# EAGLE schematic bms_master_V01 (EAGLE 7.2.0), part 1 of 2

## Sheet 1 of 9
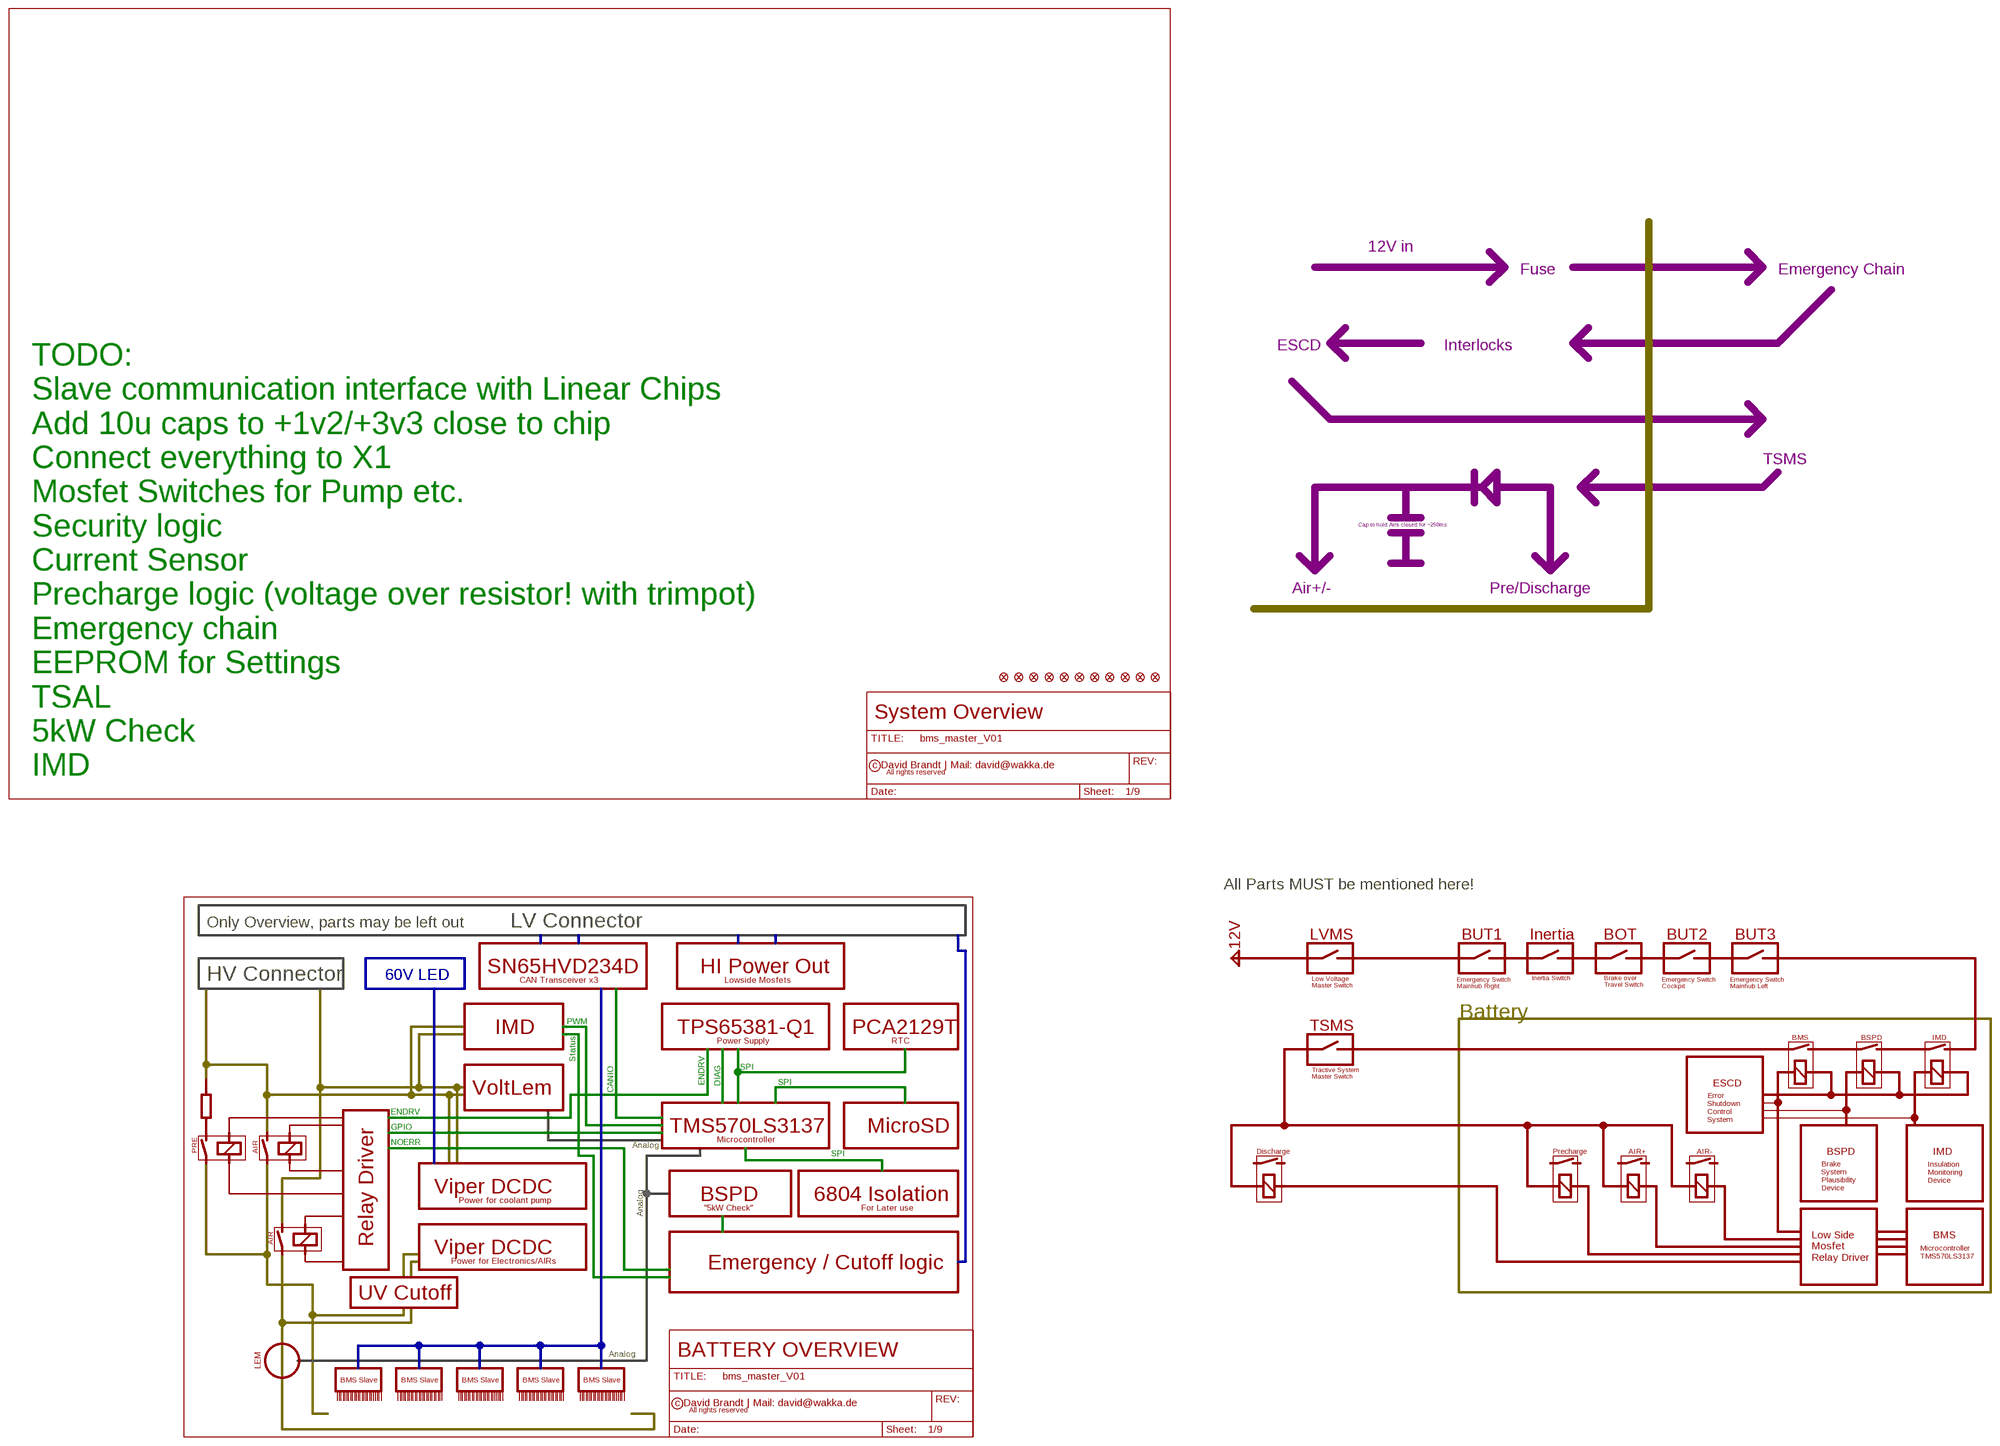
[diagram p0: schematic, sheet 1]

### Parts
FID1  FIDUCIAL""  [FIDUCIAL_1MM]
FID2  FIDUCIAL""  [FIDUCIAL_1MM]
FID3  FIDUCIAL""  [FIDUCIAL_1MM]
FID4  FIDUCIAL""  [FIDUCIAL_1MM]
FID5  FIDUCIAL""  [FIDUCIAL_1MM]
FID6  FIDUCIAL""  [FIDUCIAL_1MM]
FID7  FIDUCIAL""  [FIDUCIAL_1MM]
FID8  FIDUCIAL""  [FIDUCIAL_1MM]
FID9  FIDUCIAL""  [FIDUCIAL_1MM]
FID10  FIDUCIAL""  [FIDUCIAL_1MM]
FID11  FIDUCIAL""  [FIDUCIAL_1MM]

### Buses
B$2
B$3
B$4
B$5
B$6
B$7

### Notes on the sheet
- 12V in
- Fuse | Emergency Chain
- ESCD | Interlocks
- TSMS
- Cap to hold Airs closed for ~250ms
- Air+/- | Pre/Discharge
- TODO:
  Slave communication interface with Linear Chips
  Add 10u caps to +1v2/+3v3 close to chip
  Connect everything to X1
  Mosfet Switches for Pump etc.
  Security logic
  Current Sensor
  Precharge logic (voltage over resistor! with trimpot)
  Emergency chain
  EEPROM for Settings
  TSAL
  5kW Check
  IMD
- All Parts MUST be mentioned here!
- Only Overview, parts may be left out | LV Connector
- LVMS | BUT1 | Inertia | BOT | BUT2 | BUT3
- 12V
- SN65HVD234D | HI Power Out
- HV Connector | 60V LED | Inertia Switch
- CAN Transceiver x3 | Lowside Mosfets
- Brake over
  Travel Switch
- Low Voltage
  Master Switch
- Emergency Switch
  Mainhub Right
- Emergency Switch
  Cockpit
- Emergency Switch
  Mainhub Left
- Battery
- PWM
- IMD | TPS65381-Q1 | PCA2129T | TSMS
- BMS | BSPD | IMD
- Power Supply | RTC
- Status
- SPI
- Tractive System
  Master Switch
- ENDRV | DIAG | SPI | ESCD
- VoltLem | CANIO
- ENDRV
- Error
  Shutdown
  Control
  System
- GPIO
- TMS570LS3137 | MicroSD
- Microcontroller
- NOERR
- Analog
- PRE | AIR | Discharge | Precharge | AIR+ | AIR- | BSPD | IMD
- SPI
- Insulation
  Monitoring
  Device
- Brake
  System
  Plausibility
  Device
- Viper DCDC
- Power for coolant pump | BSPD | 6804 Isolation
- "5kW Check" | For Later use
- Analog
- BMS
- AIR
- Relay Driver
- Viper DCDC
- Microcontroller
  TMS570LS3137
- Low Side
  Mosfet
  Relay Driver
- Power for Electronics/AIRs
- Emergency / Cutoff logic
- UV Cutoff
- Analog
- LEM
- BMS Slave | BMS Slave | BMS Slave | BMS Slave | BMS Slave

## Sheet 2 of 9
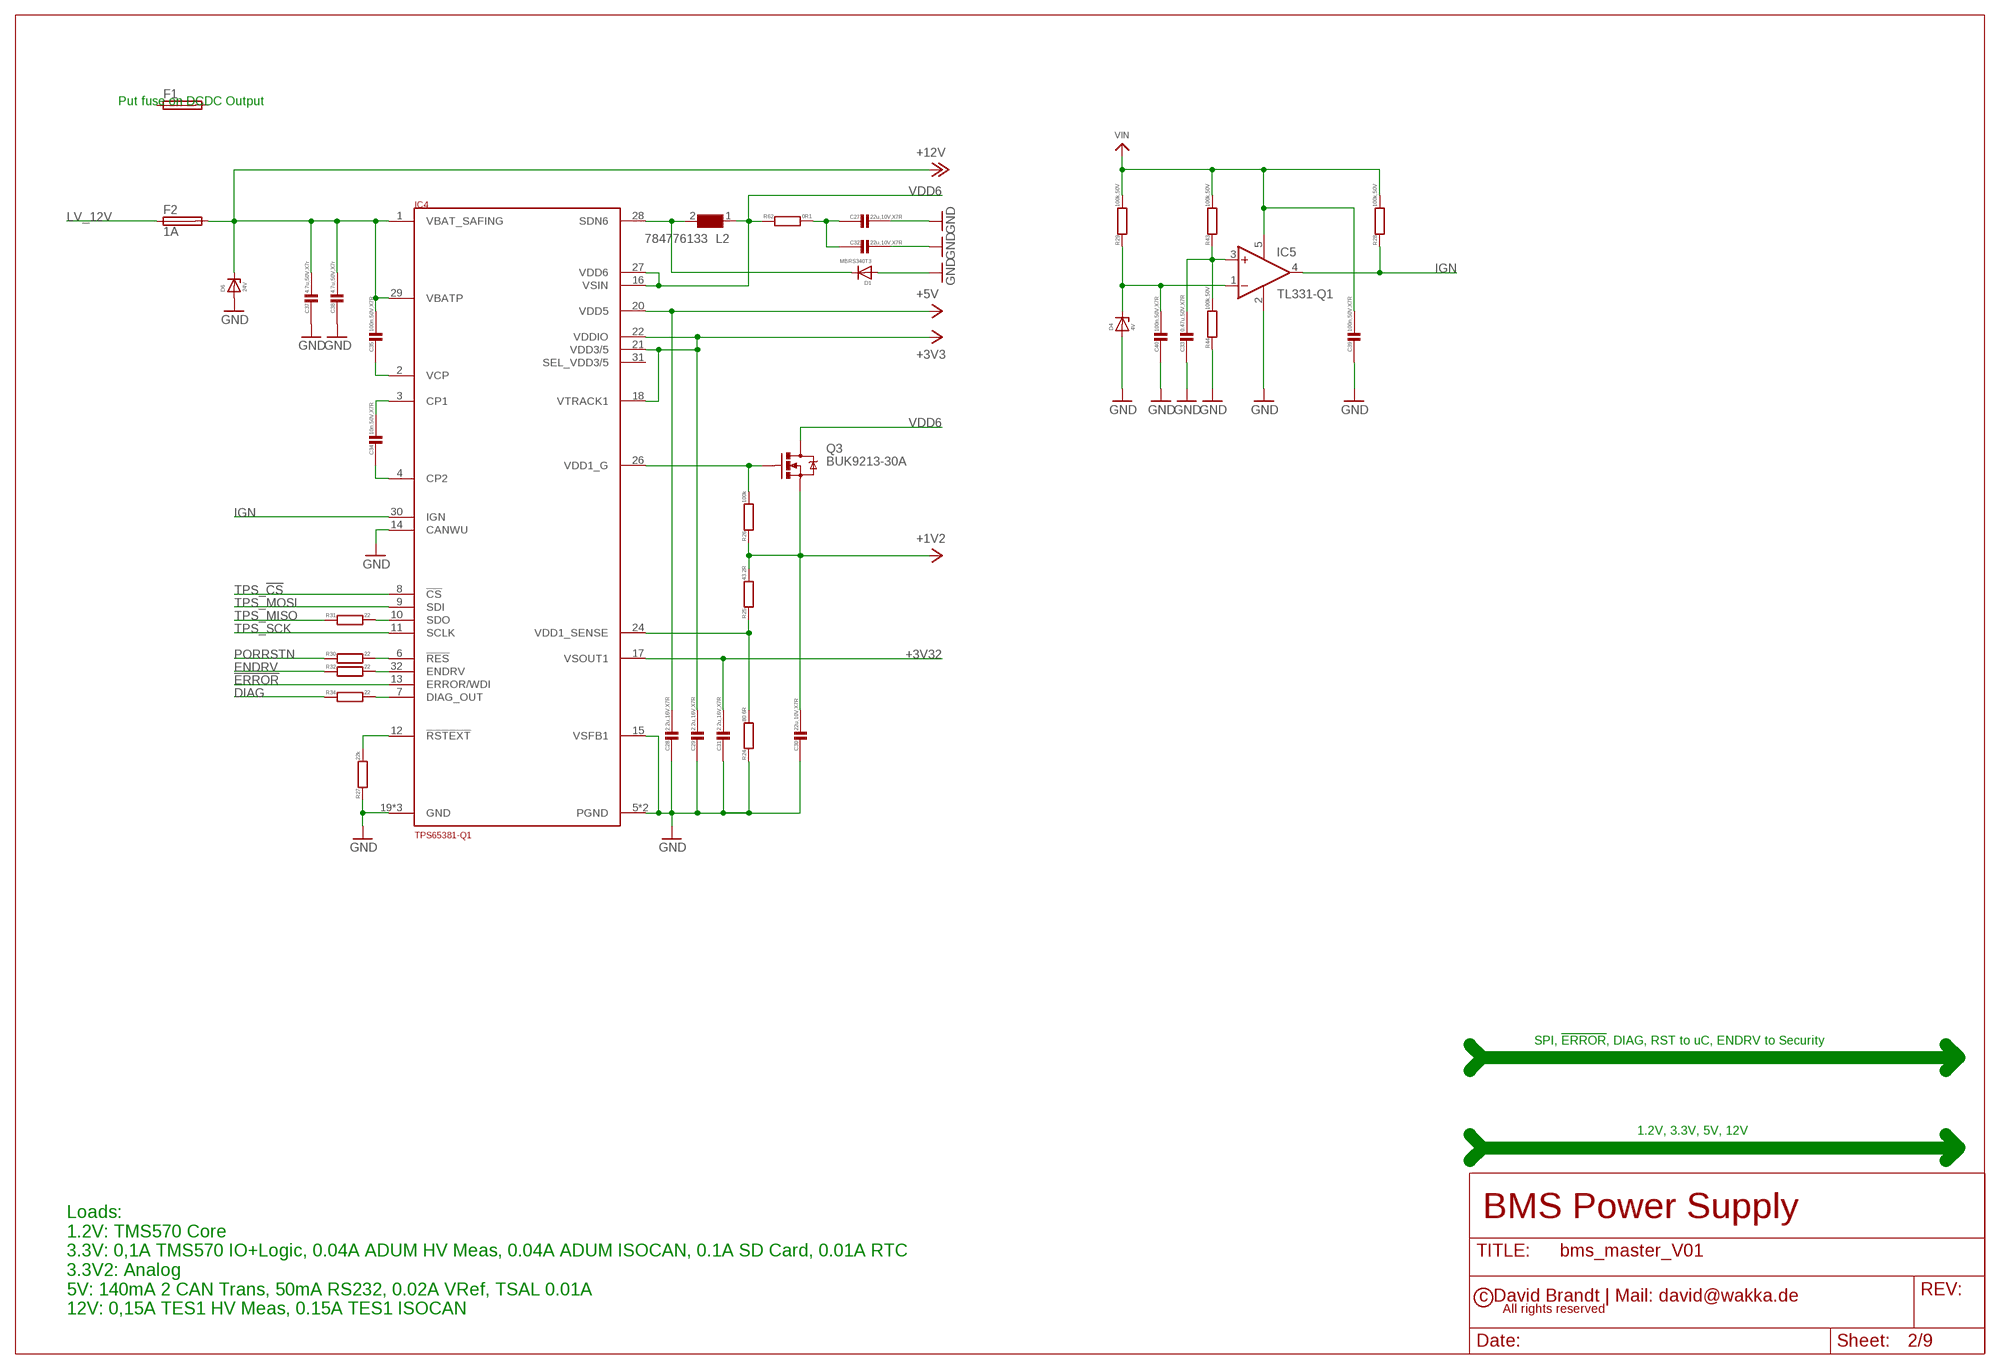
[diagram p1: schematic, sheet 2]

### Parts
C27  22u,10V,X7R  C1206  [C1206]
C28  2.2u,16V,X7R  C0603  [C0603]
C29  2.2u,16V,X7R  C0603  [C0603]
C30  22u,10V,X7R  C1206  [C1206]
C31  2.2u,16V,X7R  C0603  [C0603]
C32  22u,10V,X7R  C1206  [C1206]
C33  0.47u,50V,X7R  C0603  [C0603]
C34  10n,50V,X7R  C0603  [C0603]
C35  100n,50V,X7R  C0603  [C0603]
C37  4.7u,50V,X7r  C1210  [C1210]
C38  4.7u,50V,X7r  C1210  [C1210]
C39  100n,50V,X7R  C0603  [C0603]
C40  100n,50V,X7R  C0603  [C0603]
D1  MBRS340T3  DIODE-SMC  [SMC]
D4  4V  ZENERSOD323  [SOD323-L]
D6  24V  ZENERSMB  [SMB]
F1  FUSE-LFMINIHOLDER  [LITTLEFUSE_17867640001]
F2  1A  FUSE-LFMINIHOLDER  [LITTLEFUSE_17867640001]
IC4  TPS65381-Q1  [DAP-R-PDSO-G32]
IC5  TL331-Q1  TL331  [DBV-R-PDSO-G5]
L2  784776133  WE-PD2_1054  [WE-PD2_1054]
Q3  BUK9213-30A  MOSFET-NCHANNELFDD8780  [DPAK]
R24  80.6R  R0603  [R0603]
R25  43.2R  R0603  [R0603]
R26  100k  R0402  [R0402]
R27  22k  R0402  [R0402]
R28  100k,50V  R0603  [R0603]
R29  100k,50V  R0603  [R0603]
R30  22  R0402  [R0402]
R31  22  R0402  [R0402]
R32  22  R0402  [R0402]
R34  22  R0402  [R0402]
R43  100k,50V  R0603  [R0603]
R44  100k,50V  R0603  [R0603]
R62  0R1  R1206  [R1206]

### Nets
8VREF: C40.1 D4.C IC5.1(-IN) R29.1
!ERROR: IC4.13(ERROR/WDI) ; also sheet 6
+1V2: C30.1 Q3.3(S) R25.2 R26.1 ; also sheet 6
+3V3: C29.1 IC4.18(VTRACK1) IC4.21(VDD3/5) IC4.22(VDDIO) ; also sheet 3,4,5,6,7,8
+3V32: C31.1 IC4.17(VSOUT1) ; also sheet 6,8
+5V: C28.1 IC4.20(VDD5) ; also sheet 6,7,9
+12V: C35.1 C37.1 C38.1 D6.C F2.2 IC4.1(VBAT_SAFING) IC4.29(VBATP) ; also sheet 3,4,5,7
CP1: C34.1 IC4.3(CP1)
CP2: C34.2 IC4.4(CP2)
DIAG: R34.1 ; also sheet 8
DIAG_OUT: IC4.7(DIAG_OUT) R34.2
ENDRV: R32.1 ; also sheet 5,8
ENDRVOUT: IC4.32(ENDRV) R32.2
GND: C27.1 C28.2 C29.2 C30.2 C31.2 C32.1 C33.2 C37.2 C38.2 C39.2 C40.2 D1.A D4.A D6.A IC4.5(PGND) IC4.14(CANWU) IC4.15(VSFB1) IC4.19(GND) IC4.23(GND) IC4.25(PGND) IC4.P(GND) IC5.2(GND) R24.1 R27.1 R44.1 ; also sheet 3,4,5,6,7,8,9
IGN: IC4.30(IGN) IC5.4(OUT) R28.1
LV_12V: F2.1 ; also sheet 4
N$4: C33.1 IC5.3(+IN) R43.1 R44.2
N$6: C27.2 C32.2 R62.2
N$7: D1.C IC4.28(SDN6) L2.2
PORRSTN: R30.1 ; also sheet 6
PORRSTOUT: IC4.6(!RES) R30.2
RSTEXT: IC4.12(!RSTEXT) R27.2
SDO: IC4.10(SDO) R31.2
TPS_!CS: IC4.8(!CS) ; also sheet 8
TPS_MISO: R31.1 ; also sheet 6,8
TPS_MOSI: IC4.9(SDI) ; also sheet 6,8
TPS_SCK: IC4.11(SCLK) ; also sheet 6,8
VCP: C35.2 IC4.2(VCP)
VDD1_G: IC4.26(VDD1_G) Q3.1(G) R26.2
VDD1_SENSE: IC4.24(VDD1_SENSE) R24.2 R25.1
VDD6: IC4.16(VSIN) IC4.27(VDD6) L2.1 Q3.4(D) R62.1
VIN: C39.1 IC5.5(V+) R28.2 R29.2 R43.2 ; also sheet 9
Unconnected: F1.1 F1.2 IC4.31(SEL_VDD3/5)

### Notes on the sheet
- Put fuse on DCDC Output
- SPI, !ERROR!, DIAG, RST to uC, ENDRV to Security
- 1.2V, 3.3V, 5V, 12V
- Loads:
  1.2V: TMS570 Core
  3.3V: 0,1A TMS570 IO+Logic, 0.04A ADUM HV Meas, 0.04A ADUM ISOCAN, 0.1A SD Card, 0.01A RTC
  3.3V2: Analog
  5V: 140mA 2 CAN Trans, 50mA RS232, 0.02A VRef, TSAL 0.01A
  12V: 0,15A TES1 HV Meas, 0.15A TES1 ISOCAN

## Sheet 3 of 9
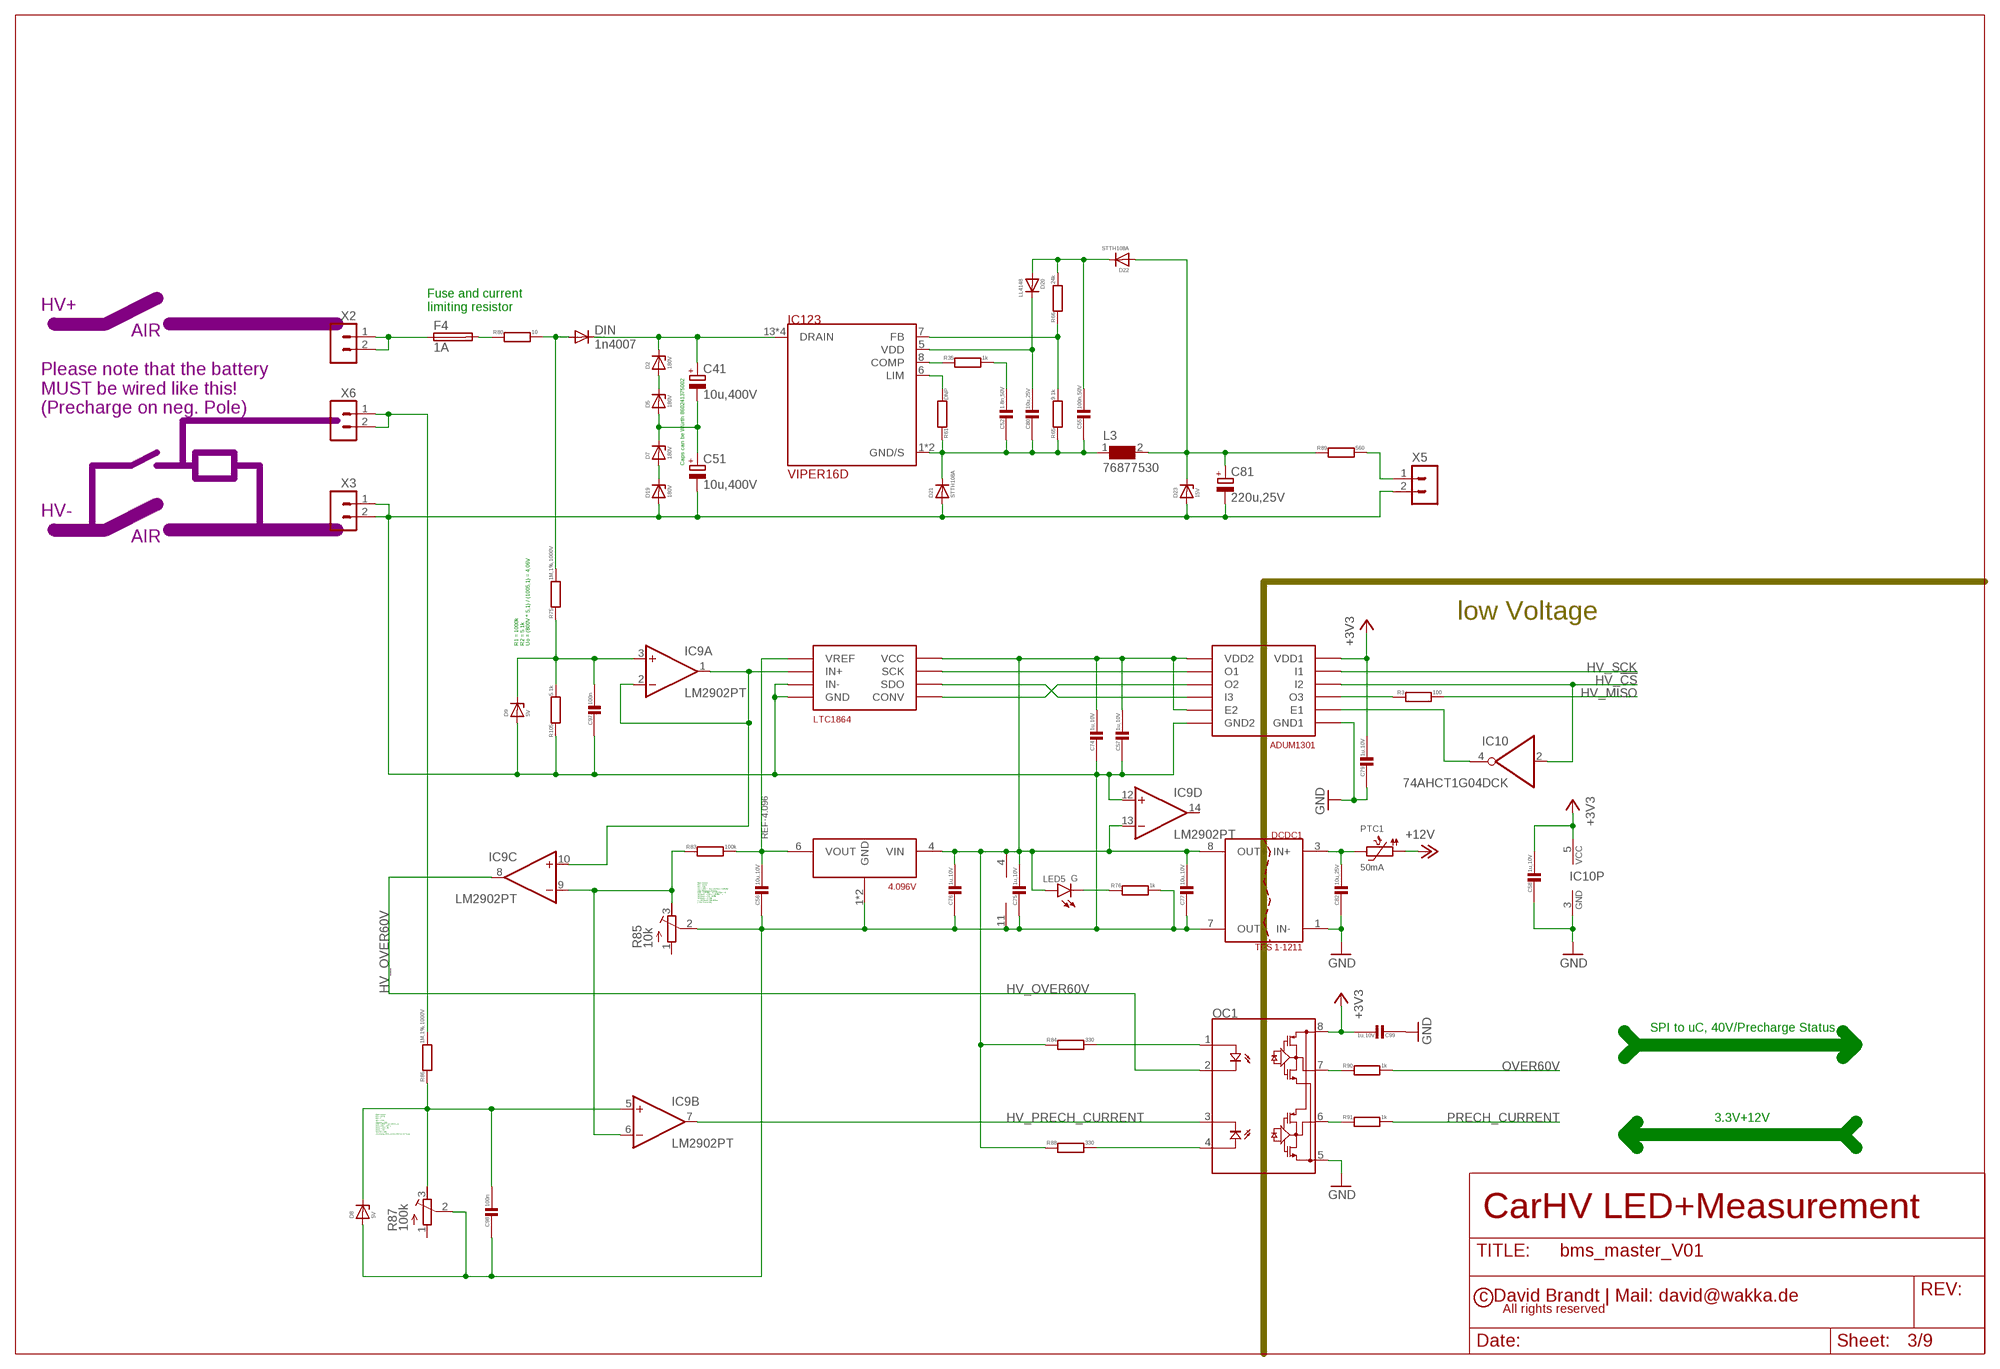
[diagram p2: schematic, sheet 3]

### Parts
C41  10u,400V  CPOL-EUE5-10.5  [E5-10,5]
C51  10u,400V  CPOL-EUE5-10.5  [E5-10,5]
C52  1.8n,50V  C0603  [C0603]
C55  100n,50V  C0603  [C0603]
C56  10u,10V  C0603  [C0603]
C57  1u,10V  C0402  [C0402]
C58  1u,10V  C0402  [C0402]
C74  1u,10V  C0402  [C0402]
C75  1u,10V  C0402  [C0402]
C76  1u,10V  C0402  [C0402]
C77  10u,10V  C0603  [C0603]
C79  1u,10V  C0402  [C0402]
C80  10u,25V  C1210  [C1210]
C81  220u,25V  CPOL-EUE3.5-8  [E3,5-8]
C82  10u,25V  C1210  [C1210]
C97  100n  C0603  [C0603]
C98  100n  C0603  [C0603]
C99  1u,10V  C0402  [C0402]
D2  180V  ZENERSMA  [DO-214AC]
D5  180V  ZENERSMA  [DO-214AC]
D7  180V  ZENERSMA  [DO-214AC]
D8  5V  ZENERSOD323  [SOD323-L]
D9  5V  ZENERSOD323  [SOD323-L]
D19  180V  ZENERSMA  [DO-214AC]
D20  LL4148  DIODE-MINIMELF  [MINIMELF]
D21  STTH108A  DIODE-SMA  [DO-214AC]
D22  STTH108A  DIODE-SMA  [DO-214AC]
D23  15V  ZENERSMA  [DO-214AC]
DCDC1  TES 1-1211  DCDC_ISOSMD_TES1  [DCDC_SMD_TES1]
DIN  1n4007  DIODE-DO-214AC  [DO-214AC]
F4  1A  FUSE-LF485  [LF485]
IC9  LM2902PT  [SSOP14]
IC10  74AHCT1G04DCK  [SC70-5]
IC123  VIPER16D  [SO16]
L3  76877530  WE-PD2_HV_7850  [WE-PD2_7850]
LED5  G  LED0603  [CHIPLED_0603]
OC1  ACPL-K7X  [SO-8-STRETCHED]
PTC1  50mA  PTC1210  [PTC1210]
R3  100  R0402  [R0402]
R35  1k  R0603  [R0603]
R61  DNP  R0603  [R0603]
R65  9.1k  R0603  [R0603]
R66  24k  R0603  [R0603]
R75  1M,1%,1000V  R2512  [R2512]
R76  1k  R0402  [R0402]
R80  10  R1206  [R1206]
R83  100k  R0402  [R0402]
R84  330  R0402  [R0402]
R85  10k  R-TRIMM3224W  [RTRIM3224W]
R86  1M,1%,1000V  R2512  [R2512]
R87  100k  R-TRIMM3224W  [RTRIM3224W]
R88  330  R0402  [R0402]
R89  560  R1206  [R1206]
R90  1k  R0402  [R0402]
R91  1k  R0402  [R0402]
R105  5.1k  R1206  [R1206]
U$3  4.096V  LT6656  [SOT23-6]
U$20  LTC1864  [MS8]
U$22  ADUM1301  [SO16WB]
X2  HEADER_POS2_43650-0212  [43650-0212]
X3  HEADER_POS2_43650-0212  [43650-0212]
X5  HEADER_POS2_43650-0212  [43650-0212]
X6  HEADER_POS2_43650-0212  [43650-0212]

### Nets
+3V3: C58.1 C79.1 C99.1 IC10.5(VCC) OC1.8 U$22.P$1(VDD1) ; also sheet 2,4,5,6,7,8
+12V: PTC1.P$1 ; also sheet 2,4,5,7
CHV_5V: C57.1 C74.1 C75.1 C76.1 C77.1 DCDC1.8(OUT+) IC9.4(P:V+) IC9.13(D:-IN) LED5.A R84.1 R88.1 U$3.4(VIN) U$20.P$8(VCC) U$22.P$10(E2) U$22.P$16(VDD2)
CHV_+: F4.1 X2.1 X2.2
CHV_+_FUSED: F4.2 R80.1
CHV_+_FUSEDR: DIN.A R75.2 R80.2
CHV_CONV: U$20.P$5(CONV) U$22.P$13(O2)
CHV_GND: C51.- C56.2 C57.2 C74.2 C75.2 C76.2 C77.2 C81.- C97.2 C98.2 D8.A D9.A D19.A D21.A D23.A DCDC1.7(OUT-) IC9.11(P:V-) IC9.12(D:+IN) R76.2 R85.2(S) R87.2(S) R105.1 U$3.1(GND) U$3.2(GND) U$20.P$3(IN-) U$20.P$4(GND) U$22.P$9(GND2) U$22.P$15(GND2) X3.1 X3.2 X5.2
CHV_LEDC: LED5.C R76.1
CHV_M: C97.1 D9.C IC9.3(A:+IN) R75.1 R105.2
CHV_M1: C98.1 D8.C IC9.5(B:+IN) R86.1 R87.3(E)
CHV_MOP: IC9.1(A:OUT) IC9.2(A:-IN) IC9.10(C:+IN) U$20.P$2(IN+)
CHV_SCK: U$20.P$7(SCK) U$22.P$14(O1)
CHV_SDO: U$20.P$6(SDO) U$22.P$12(I3)
CLV_12V_TES1_FUSED: C82.1 DCDC1.3(IN+) PTC1.P$2
GND: C58.2 C79.2 C82.2 C99.2 DCDC1.1(IN-) IC10.3(GND) OC1.5 U$22.P$2(GND1) U$22.P$8(GND1) ; also sheet 2,4,5,6,7,8,9
HV_!CS: IC10.2(I) U$22.P$4(I2) ; also sheet 8
HV_MISO: R3.2 ; also sheet 8
HV_OVER60V: IC9.8(C:OUT) OC1.2
HV_PRECH_CURRENT: IC9.7(B:OUT) OC1.3
HV_SCK: U$22.P$3(I1) ; also sheet 8
N$1: IC10.4(O) U$22.P$7(E1)
N$3: R3.1 U$22.P$5(O3)
N$72: R86.2 X6.1 X6.2
N$73: OC1.1 R84.2
N$74: OC1.4 R88.2
OVER60V: R90.2 ; also sheet 4,8
PRECH_CURRENT: R91.2 ; also sheet 5,8
R!OVER40V: OC1.7 R90.1
R!PRECH_CURRENT: OC1.6 R91.1
REF0.3W: IC9.6(B:-IN) IC9.9(C:-IN) R83.1 R85.3(E)
REF-4.096: C56.1 R83.2 U$3.6(VOUT) U$20.P$1(VREF)
VP+3/4: D7.A D19.C
VP_12V: C81.+ D22.A D23.C L3.2 R89.1
VP_12VINT: C55.1 D20.A D22.C R66.2
VP_+: C41.+ D2.C DIN.C IC123.13(DRAIN) IC123.14(DRAIN) IC123.15(DRAIN) IC123.16(DRAIN)
VP_+1/3: D2.A D5.C
VP_+/2: C41.- C51.+ D5.A D7.C
VP_COMP: IC123.8(COMP) R35.1
VP_COMPM: C52.1 R35.2
VP_FB: IC123.7(FB) R65.2 R66.1
VP_LED: R89.2 X5.1
VP_LIM: IC123.6(LIM) R61.2
VP_S: C52.2 C55.2 C80.2 D21.C IC123.1(GND/S) IC123.2(GND/S) L3.1 R61.1 R65.1
VP_VDD: C80.1 D20.C IC123.5(VDD)
Unconnected: IC9.14(D:OUT) R85.1(A) R87.1(A)

### Notes on the sheet
- HV+
- Fuse and current
  limiting resistor
- AIR
- Please note that the battery
  MUST be wired like this!
  (Precharge on neg. Pole)
- Caps can be Würth 860241375002
- HV-
- AIR
- low Voltage
- R1 = 1000k
  R2 = 5.1k
  Uo = (800V * 5,1) / (1005,1) = 4,06V
- Main divider:
  R1 = 1000k
  R2 = 5.1k
  Uo = (60V * 5,1) / (1005,1) = 0.3045V
  0.3V Reference Divider:
  0.3V = (4.096V * x) / (100Ohm + x)
  30OhmV + 0.3Vx = 4.096V * x
  30Ohm/x + 0.3= 4.096
  30Ohm/x = 3.796
  x = 30Ohm/3.796 =8Ohm
  (~10k Pot is OK)
- SPI to uC, 40V/Precharge Status
- 3.3V+12V
- Main divider:
  R1 = 1000k
  R2 = ?
  Uo = 0.3V
  Uimean = 10V
  0.3V = (10V * x) / (1000 + x)
  300 + 0.3x = 10 * x
  300/x + 0.3 = 10
  300/x = 9.7
  300/9.7 = 30k
  choosing 100k pot for 30V to 0V Span

## Sheet 4 of 9
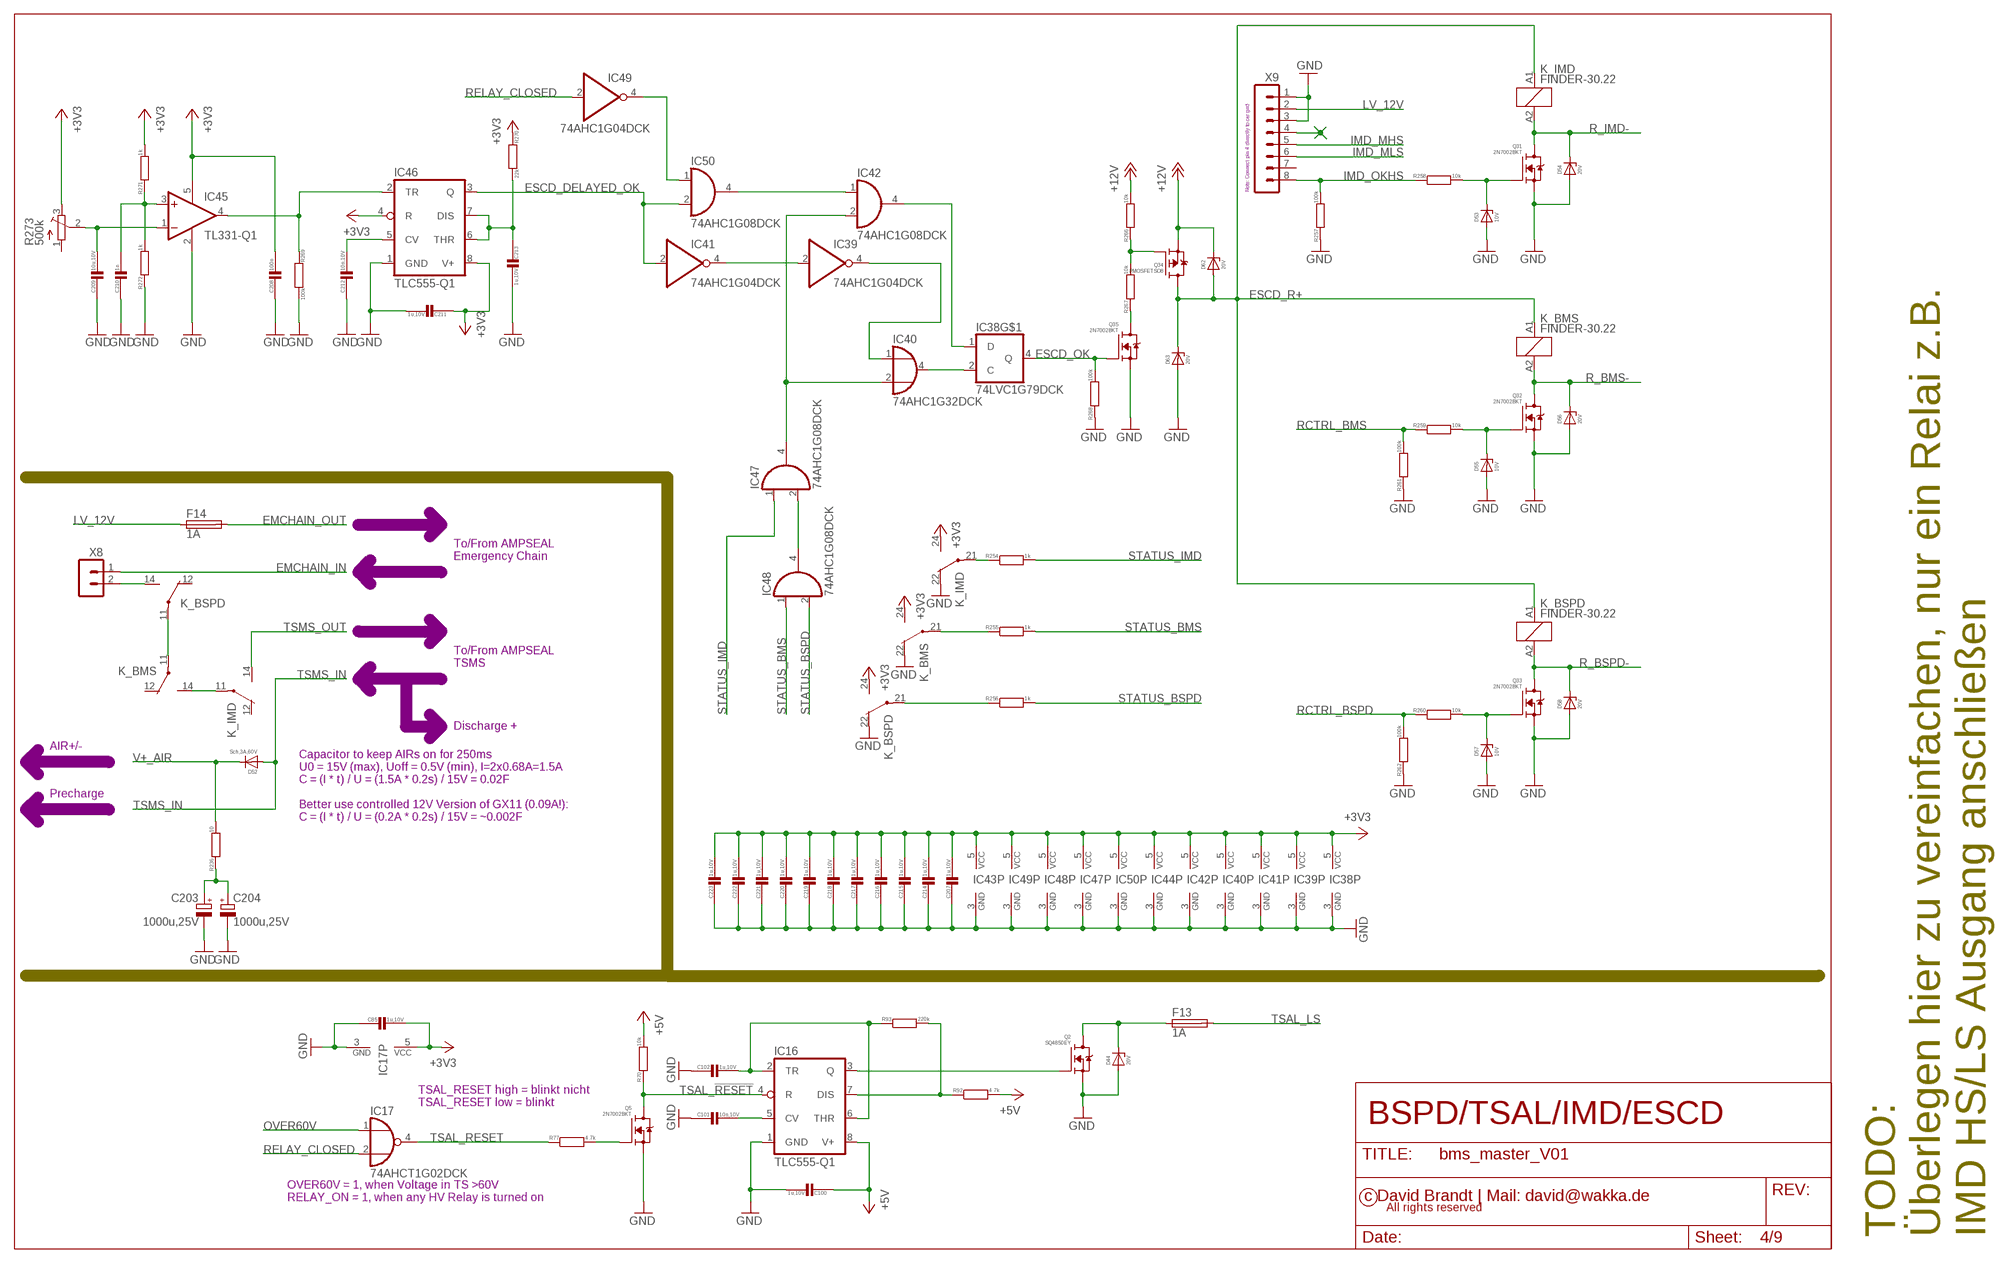
[diagram p3: schematic, sheet 4]

### Parts
C85  1u,10V  C0402  [C0402]
C100  1u,10V  C0402  [C0402]
C101  10n,10V  C0402  [C0402]
C102  1u,10V  C0402  [C0402]
C203  1000u,25V  CPOL-EUE5-13  [E5-13]
C204  1000u,25V  CPOL-EUE5-13  [E5-13]
C207  1u,10V  C0402  [C0402]
C208  100n  C0402  [C0402]
C209  10u,10V  C0603  [C0603]
C210  1n  C0402  [C0402]
C211  1u,10V  C0402  [C0402]
C212  10n,10V  C0402  [C0402]
C213  1u,10V  C0402  [C0402]
C214  1u,10V  C0402  [C0402]
C215  1u,10V  C0402  [C0402]
C216  1u,10V  C0402  [C0402]
C217  1u,10V  C0402  [C0402]
C218  1u,10V  C0402  [C0402]
C219  1u,10V  C0402  [C0402]
C220  1u,10V  C0402  [C0402]
C221  1u,10V  C0402  [C0402]
C222  1u,10V  C0402  [C0402]
C223  1u,10V  C0402  [C0402]
D44  20V  ZENERSMA  [DO-214AC]
D52  Sch,3A,60V  DIODE-SMA  [DO-214AC]
D53  10V  ZENERSOD323  [SOD323-L]
D54  20V  ZENERSMA  [DO-214AC]
D55  10V  ZENERSOD323  [SOD323-L]
D56  20V  ZENERSMA  [DO-214AC]
D57  10V  ZENERSOD323  [SOD323-L]
D58  20V  ZENERSMA  [DO-214AC]
D62  20V  ZENERSMA  [DO-214AC]
D63  20V  ZENERSMA  [DO-214AC]
F13  1A  FUSE-LFMINIHOLDER  [LITTLEFUSE_17867640001]
F14  1A  FUSE-LFMINIHOLDER  [LITTLEFUSE_17867640001]
IC16  TLC555-Q1  NE555D  [SO08]
IC17  74AHCT1G02DCK  [SC70-5]
IC38  74LVC1G79DCK  [SC70-5]
IC39  74AHC1G04DCK  [SC70-5]
IC40  74AHC1G32DCK  [SC70-5]
IC41  74AHC1G04DCK  [SC70-5]
IC42  74AHC1G08DCK  [SC70-5]
IC43  74AHC1G32DCK  [SC70-5]
IC44  74AHC1G02DCK  [SC70-5]
IC45  TL331-Q1  TL331  [DBV-R-PDSO-G5]
IC46  TLC555-Q1  NE555D  [SO08]
IC47  74AHC1G08DCK  [SC70-5]
IC48  74AHC1G08DCK  [SC70-5]
IC49  74AHC1G04DCK  [SC70-5]
IC50  74AHC1G08DCK  [SC70-5]
K_BMS  FINDER-30.22  [FINDER-30.22]
K_BSPD  FINDER-30.22  [FINDER-30.22]
K_IMD  FINDER-30.22  [FINDER-30.22]
Q2  SQ4850EY  NMOSFETSO8  [SO-8]
Q5  2N7002BKT  [SOT416]
Q31  2N7002BKT  [SOT416]
Q32  2N7002BKT  [SOT416]
Q33  2N7002BKT  [SOT416]
Q34  PMOSFETSO8  [SO-8]
Q35  2N7002BKT  [SOT416]
R70  10k  R0402  [R0402]
R77  4.7k  R0402  [R0402]
R92  4.7k  R0402  [R0402]
R93  220k  R0402  [R0402]
R236  10  R1206  [R1206]
R254  1k  R0402  [R0402]
R255  1k  R0402  [R0402]
R256  1k  R0402  [R0402]
R257  100k  R0402  [R0402]
R258  10k  R0402  [R0402]
R259  10k  R0402  [R0402]
R260  10k  R0402  [R0402]
R261  100k  R0402  [R0402]
R262  100k  R0402  [R0402]
R266  10k  R0402  [R0402]
R267  10k  R0402  [R0402]
R268  100k  R0402  [R0402]
R269  100k  R0402  [R0402]
R270  22k  R0402  [R0402]
R271  1k  R0402  [R0402]
R272  1k  R0402  [R0402]
R273  500k  TRIM_EU-3223W  [3223W]
X8  HEADER_POS2_43650-0212  [43650-0212]
X9  HEADER_POS8_43650-0812  [43650-0812]

### Nets
8VREF1: C209.1 IC45.1(-IN) R273.2(S)
+3V3: C85.1 C207.1 C208.1 C211.2 C214.1 C215.1 C216.1 C217.1 C218.1 C219.1 C220.1 C221.1 C222.1 C223.1 IC17.5(VCC) IC38.5(VCC) IC39.5(VCC) IC40.5(VCC) IC41.5(VCC) IC42.5(VCC) IC43.5(VCC) IC44.5(VCC) IC45.5(V+) IC46.4(R) IC46.8(V+) IC47.5(VCC) IC48.5(VCC) IC49.5(VCC) IC50.5(VCC) K_BMS.24(-2:S) K_BSPD.24(-2:S) K_IMD.24(-2:S) R270.1 R271.2 R273.3(E) ; also sheet 2,3,5,6,7,8
+12V: D62.C Q34.1(S) Q34.2(S) Q34.3(S) R266.2 ; also sheet 2,3,5,7
CAR+5V: C100.2 IC16.8(V+) R70.2 R92.2 ; supply symbol labelled +5V
EMCHAIN_IN: X8.1
EMCHAIN_OUT: F14.2
ESCD_DELAYED_OK: IC41.2(I) IC46.3(Q) IC50.2(I1)
ESCD_OK: IC38.4(Q) Q35.1(G) R268.2
ESCD_R+: D62.A D63.C K_BMS.A1 K_BSPD.A1 K_IMD.A1 Q34.5(D) Q34.6(D) Q34.7(D) Q34.8(D)
GND: C85.2 C100.1 C101.2 C102.2 C203.- C204.- C207.2 C208.2 C209.2 C210.2 C211.1 C212.2 C213.1 C214.2 C215.2 C216.2 C217.2 C218.2 C219.2 C220.2 C221.2 C222.2 C223.2 D44.A D53.A D54.A D55.A D56.A D57.A D58.A D63.A IC16.1(GND) IC17.3(GND) IC38.3(GND) IC39.3(GND) IC40.3(GND) IC41.3(GND) IC42.3(GND) IC43.3(GND) IC44.3(GND) IC45.2(GND) IC46.1(GND) IC47.3(GND) IC48.3(GND) IC49.3(GND) IC50.3(GND) K_BMS.22(-2:O) K_BSPD.22(-2:O) K_IMD.22(-2:O) Q2.1(S) Q2.2(S) Q2.3(S) Q5.2(S) Q31.2(S) Q32.2(S) Q33.2(S) Q35.2(S) R257.1 R261.1 R262.1 R268.1 R269.2 R272.1 X9.1 X9.3 ; also sheet 2,3,5,6,7,8,9
IMD_MHS: X9.5
IMD_MLS: X9.6
IMD_OKHS: R257.2 R258.1 X9.8
LV_12V: F14.1 X9.2 ; also sheet 2
N$83: IC16.3(Q) Q2.4(G)
N$168: K_BSPD.14(-1:S) X8.2
N$169: K_BMS.11(-1:P) K_BSPD.11(-1:P)
N$170: K_BMS.14(-1:S) K_IMD.11(-1:P)
N$171: C203.+ C204.+ R236.1
N$172: K_BSPD.21(-2:P) R256.1
N$173: K_BMS.21(-2:P) R255.1
N$174: K_IMD.21(-2:P) R254.1
N$176: X9.4
N$177: D53.C Q31.1(G) R258.2
N$178: D55.C Q32.1(G) R259.2
N$179: D57.C Q33.1(G) R260.2
N$181: Q34.4(G) R266.1 R267.2
N$182: Q35.3(D) R267.1
N$183: IC38.2(C) IC40.4(O)
N$184: IC39.4(O) IC40.1(I0)
N$185: IC39.2(I) IC41.4(O)
N$186: IC38.1(D) IC42.4(O)
N$187: IC40.2(I1) IC42.2(I1) IC47.4(O)
N$188: IC47.2(I1) IC48.4(O)
N$189: C210.1 IC45.3(+IN) R271.1 R272.2
N$190: IC45.4(OUT) IC46.2(TR) R269.1
N$191: C213.2 IC46.6(THR) IC46.7(DIS) R270.2
N$193: IC42.1(I0) IC50.4(O)
N$194: IC49.4(O) IC50.1(I0)
OVER60V: IC17.1(I0) ; also sheet 3,8
R_BMS-: D56.C K_BMS.A2 Q32.3(D)
R_BSPD-: D58.C K_BSPD.A2 Q33.3(D)
R_IMD-: D54.C K_IMD.A2 Q31.3(D)
RCTRL_BMS: R259.1 R261.2
RCTRL_BSPD: R260.1 R262.2
RELAY_CLOSED: IC17.2(I1) IC49.2(I) ; also sheet 5,8
STATUS_BMS: IC48.1(I0) R255.2 ; also sheet 8
STATUS_BSPD: IC48.2(I1) R256.2 ; also sheet 8
STATUS_IMD: IC47.1(I0) R254.2 ; also sheet 8
TSAL_!RESET: IC16.4(R) Q5.3(D) R70.1
TSAL_CV: C101.1 IC16.5(CV)
TSAL_CV1: C212.1 IC46.5(CV)
TSAL_DIS: IC16.7(DIS) R92.1 R93.2
TSAL_DRAIN: D44.C F13.1 Q2.5(D) Q2.6(D) Q2.7(D) Q2.8(D)
TSAL_ENG: Q5.1(G) R77.2
TSAL_LS: F13.2
TSAL_RESET: IC17.4(O) R77.1
TSAL_TR: C102.1 IC16.2(TR) IC16.6(THR) R93.1
TSMS_IN: D52.A
TSMS_OUT: K_IMD.14(-1:S)
V+_AIR: D52.C R236.2
Unconnected: IC43.1(I0) IC43.2(I1) IC43.4(O) IC44.1(I0) IC44.2(I1) IC44.4(O) K_BMS.12(-1:O) K_BSPD.12(-1:O) K_IMD.12(-1:O) R273.1(A) X9.7

### Notes on the sheet
- Note: Connect pin 4 directly to car gnd
- To/From AMPSEAL
  Emergency Chain
- To/From AMPSEAL
  TSMS
- Discharge +
- AIR+/-
- Capacitor to keep AIRs on for 250ms
  U0 = 15V (max), Uoff = 0.5V (min), I=2x0.68A=1.5A
  C = (I * t) / U = (1.5A * 0.2s) / 15V = 0.02F
  
  Better use controlled 12V Version of GX11 (0.09A!):
  C = (I * t) / U = (0.2A * 0.2s) / 15V = ~0.002F
- Precharge
- TSAL_RESET high = blinkt nicht
  TSAL_RESET low = blinkt
- OVER60V = 1, when Voltage in TS >60V
  RELAY_ON = 1, when any HV Relay is turned on
- TODO:
  Überlegen hier zu vereinfachen, nur ein Relai z.B.
  IMD HS/LS Ausgang anschließen

## Sheet 5 of 9
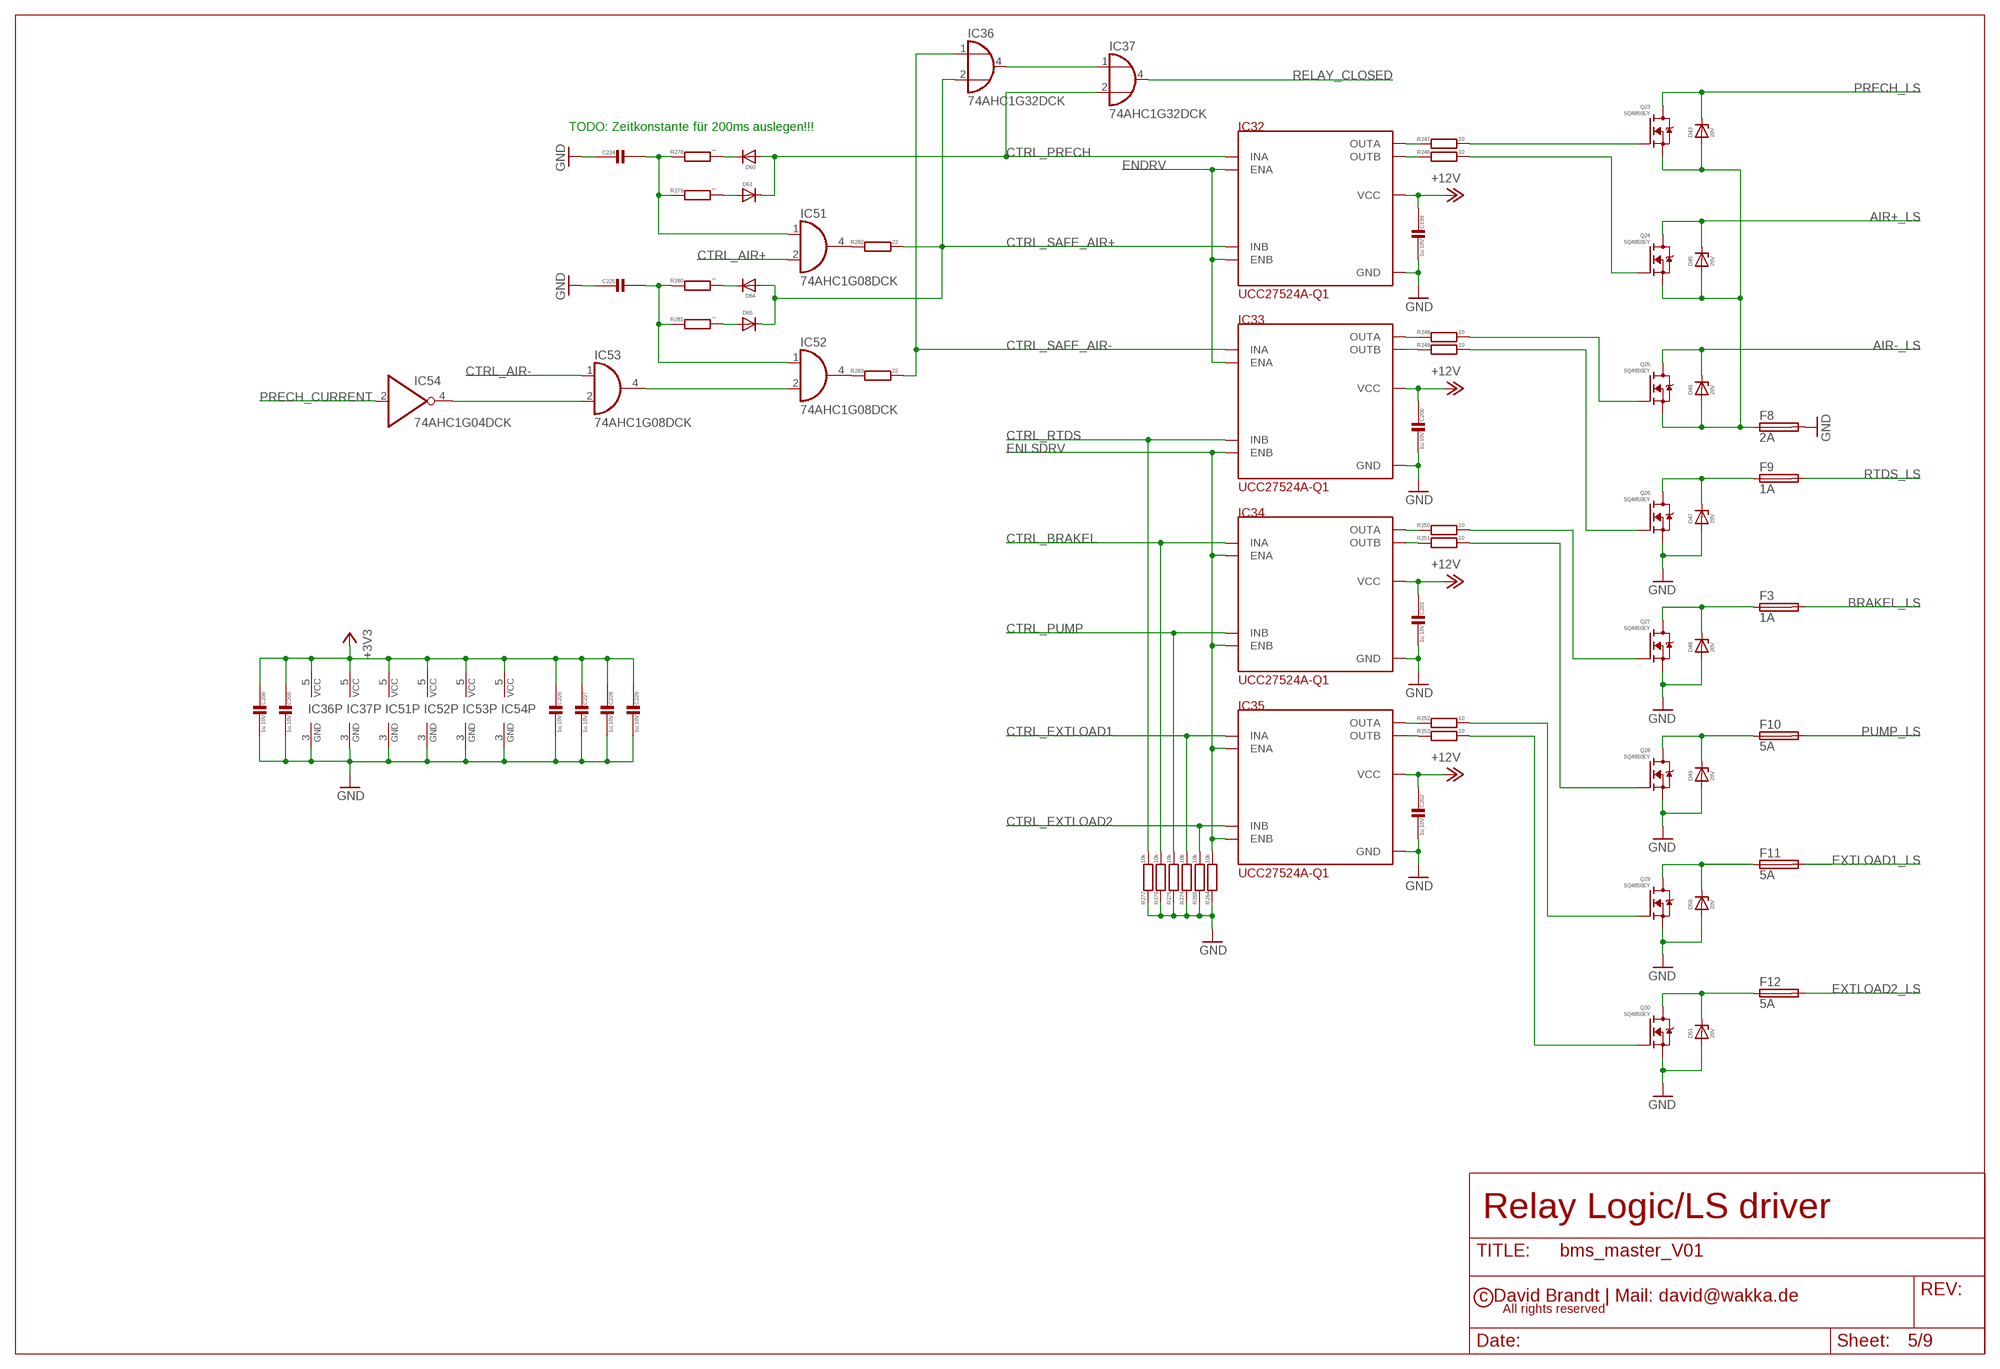
[diagram p4: schematic, sheet 5]

### Parts
C199  1u,10V  C0402  [C0402]
C200  1u,10V  C0402  [C0402]
C201  1u,10V  C0402  [C0402]
C202  1u,10V  C0402  [C0402]
C205  1u,10V  C0402  [C0402]
C206  1u,10V  C0402  [C0402]
C224  C0402  [C0402]
C225  C0402  [C0402]
C226  1u,10V  C0402  [C0402]
C227  1u,10V  C0402  [C0402]
C228  1u,10V  C0402  [C0402]
C229  1u,10V  C0402  [C0402]
D43  20V  ZENERSMA  [DO-214AC]
D45  20V  ZENERSMA  [DO-214AC]
D46  20V  ZENERSMA  [DO-214AC]
D47  20V  ZENERSMA  [DO-214AC]
D48  20V  ZENERSMA  [DO-214AC]
D49  20V  ZENERSMA  [DO-214AC]
D50  20V  ZENERSMA  [DO-214AC]
D51  20V  ZENERSMA  [DO-214AC]
D60  DIODE-SOD523  [SOD523]
D61  DIODE-SOD523  [SOD523]
D64  DIODE-SOD523  [SOD523]
D65  DIODE-SOD523  [SOD523]
F3  1A  FUSE-LFMINIHOLDER  [LITTLEFUSE_17867640001]
F8  2A  FUSE-LFMINIHOLDER  [LITTLEFUSE_17867640001]
F9  1A  FUSE-LFMINIHOLDER  [LITTLEFUSE_17867640001]
F10  5A  FUSE-LFMINIHOLDER  [LITTLEFUSE_17867640001]
F11  5A  FUSE-LFMINIHOLDER  [LITTLEFUSE_17867640001]
F12  5A  FUSE-LFMINIHOLDER  [LITTLEFUSE_17867640001]
IC32  UCC27524A-Q1  UCC27XXX-Q1  [SO08]
IC33  UCC27524A-Q1  UCC27XXX-Q1  [SO08]
IC34  UCC27524A-Q1  UCC27XXX-Q1  [SO08]
IC35  UCC27524A-Q1  UCC27XXX-Q1  [SO08]
IC36  74AHC1G32DCK  [SC70-5]
IC37  74AHC1G32DCK  [SC70-5]
IC51  74AHC1G08DCK  [SC70-5]
IC52  74AHC1G08DCK  [SC70-5]
IC53  74AHC1G08DCK  [SC70-5]
IC54  74AHC1G04DCK  [SC70-5]
Q23  SQ4850EY  NMOSFETSO8  [SO-8]
Q24  SQ4850EY  NMOSFETSO8  [SO-8]
Q25  SQ4850EY  NMOSFETSO8  [SO-8]
Q26  SQ4850EY  NMOSFETSO8  [SO-8]
Q27  SQ4850EY  NMOSFETSO8  [SO-8]
Q28  SQ4850EY  NMOSFETSO8  [SO-8]
Q29  SQ4850EY  NMOSFETSO8  [SO-8]
Q30  SQ4850EY  NMOSFETSO8  [SO-8]
R246  10  R1206  [R1206]
R247  10  R1206  [R1206]
R248  10  R1206  [R1206]
R249  10  R1206  [R1206]
R250  10  R1206  [R1206]
R251  10  R1206  [R1206]
R252  10  R1206  [R1206]
R253  10  R1206  [R1206]
R264  10k  R1206  [R1206]
R265  10k  R1206  [R1206]
R274  10k  R1206  [R1206]
R275  10k  R1206  [R1206]
R276  10k  R1206  [R1206]
R277  10k  R1206  [R1206]
R278  ""  R0402  [R0402]
R279  ""  R0402  [R0402]
R280  ""  R0402  [R0402]
R281  ""  R0402  [R0402]
R282  22  R0402  [R0402]
R283  22  R0402  [R0402]

### Nets
+3V3: C205.2 C206.2 C226.2 C227.2 C228.2 C229.2 IC36.5(VCC) IC37.5(VCC) IC51.5(VCC) IC52.5(VCC) IC53.5(VCC) IC54.5(VCC) ; also sheet 2,3,4,6,7,8
+12V: C199.2 C200.2 C201.2 C202.2 IC32.6(VCC) IC33.6(VCC) IC34.6(VCC) IC35.6(VCC) ; also sheet 2,3,4,7
AIR+_LS: D45.C Q24.5(D) Q24.6(D) Q24.7(D) Q24.8(D)
AIR-_LS: D46.C Q25.5(D) Q25.6(D) Q25.7(D) Q25.8(D)
BRAKEL_LS: F3.2
CTRL_AIR+: IC51.2(I1) ; also sheet 8
CTRL_AIR-: IC53.1(I0) ; also sheet 8
CTRL_BRAKEL: IC34.2(INA) R276.2 ; also sheet 8,9
CTRL_EXTLOAD1: IC35.2(INA) R274.2 ; also sheet 8
CTRL_EXTLOAD2: IC35.4(INB) R265.2 ; also sheet 8
CTRL_PRECH: D60.A D61.C IC32.2(INA) IC37.2(I1) ; also sheet 8
CTRL_PUMP: IC34.4(INB) R275.2 ; also sheet 8,9
CTRL_RTDS: IC33.4(INB) R277.2 ; also sheet 8,9
CTRL_SAFE_AIR+: D64.A D65.C IC32.4(INB) IC36.2(I1) R282.2 ; also sheet 8
CTRL_SAFE_AIR-: IC33.2(INA) IC36.1(I0) R283.2 ; also sheet 8
ENDRV: IC32.1(ENA) IC32.8(ENB) IC33.1(ENA) ; also sheet 2,8
ENLSDRV: IC33.8(ENB) IC34.1(ENA) IC34.8(ENB) IC35.1(ENA) IC35.8(ENB) R264.2 ; also sheet 8
EXTLOAD1_LS: F11.2
EXTLOAD2_LS: F12.2
GND: C199.1 C200.1 C201.1 C202.1 C205.1 C206.1 C224.2 C225.2 C226.1 C227.1 C228.1 C229.1 D47.A D48.A D49.A D50.A D51.A F8.2 IC32.3(GND) IC33.3(GND) IC34.3(GND) IC35.3(GND) IC36.3(GND) IC37.3(GND) IC51.3(GND) IC52.3(GND) IC53.3(GND) IC54.3(GND) Q26.1(S) Q26.2(S) Q26.3(S) Q27.1(S) Q27.2(S) Q27.3(S) Q28.1(S) Q28.2(S) Q28.3(S) Q29.1(S) Q29.2(S) Q29.3(S) Q30.1(S) Q30.2(S) Q30.3(S) R264.1 R265.1 R274.1 R275.1 R276.1 R277.1 ; also sheet 2,3,4,6,7,8,9
N$147: IC32.7(OUTA) R247.1
N$148: IC32.5(OUTB) R246.1
N$149: IC33.7(OUTA) R248.1
N$150: IC33.5(OUTB) R249.1
N$151: IC34.7(OUTA) R250.1
N$152: IC34.5(OUTB) R251.1
N$153: IC35.7(OUTA) R252.1
N$154: IC35.5(OUTB) R253.1
N$155: Q23.4(G) R247.2
N$156: Q24.4(G) R246.2
N$157: Q25.4(G) R248.2
N$158: Q26.4(G) R249.2
N$159: Q27.4(G) R250.2
N$160: Q28.4(G) R251.2
N$161: Q29.4(G) R252.2
N$162: Q30.4(G) R253.2
N$163: D51.C F12.1 Q30.5(D) Q30.6(D) Q30.7(D) Q30.8(D)
N$164: D50.C F11.1 Q29.5(D) Q29.6(D) Q29.7(D) Q29.8(D)
N$165: D49.C F10.1 Q28.5(D) Q28.6(D) Q28.7(D) Q28.8(D)
N$166: D47.C F9.1 Q26.5(D) Q26.6(D) Q26.7(D) Q26.8(D)
N$167: D48.C F3.1 Q27.5(D) Q27.6(D) Q27.7(D) Q27.8(D)
N$175: IC36.4(O) IC37.1(I0)
N$195: D61.A R279.2
N$196: D60.C R278.2
N$197: C224.1 IC51.1(I0) R278.1 R279.1
N$198: D65.A R281.2
N$199: D64.C R280.2
N$200: C225.1 IC52.1(I0) R280.1 R281.1
N$201: IC52.2(I1) IC53.4(O)
N$202: IC53.2(I1) IC54.4(O)
N$203: IC51.4(O) R282.1
N$204: IC52.4(O) R283.1
PRECH_CURRENT: IC54.2(I) ; also sheet 3,8
PRECH_LS: D43.C Q23.5(D) Q23.6(D) Q23.7(D) Q23.8(D)
PUMP_LS: F10.2
RELAY_CLOSED: IC37.4(O) ; also sheet 4,8
RELAY_GND: D43.A D45.A D46.A F8.1 Q23.1(S) Q23.2(S) Q23.3(S) Q24.1(S) Q24.2(S) Q24.3(S) Q25.1(S) Q25.2(S) Q25.3(S)
RTDS_LS: F9.2

### Notes on the sheet
- TODO: Zeitkonstante für 200ms auslegen!!!

## Sheet 6 of 9
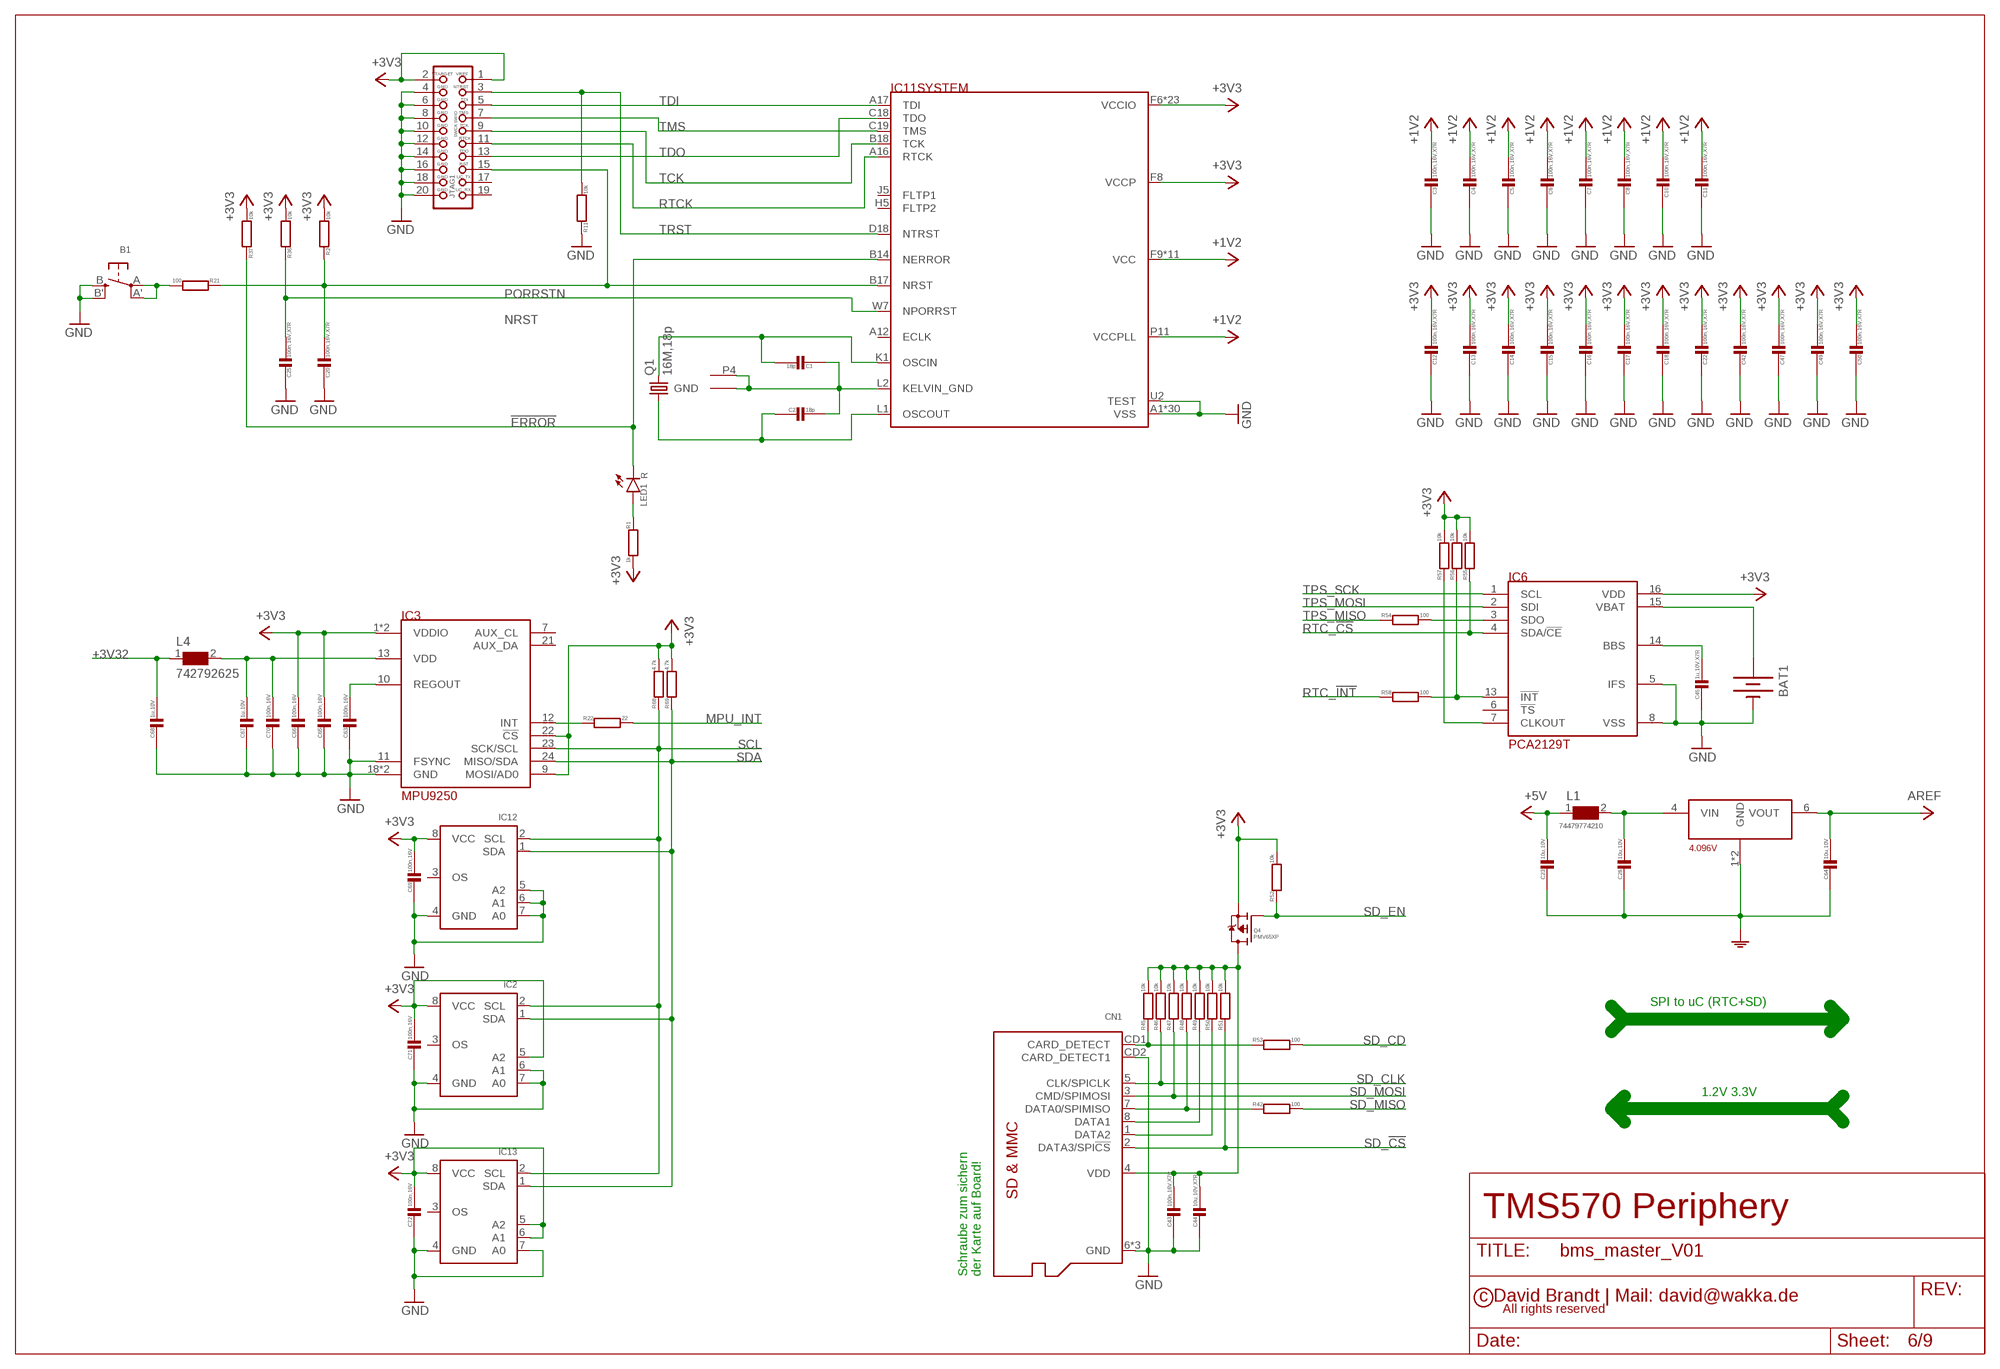
[diagram p5: schematic, sheet 6]

### Parts
B1  SWITCH_TACT_SMT4.6X2.8  [BTN_KMR2_4.6X2.8]
BAT1  BATTERY20PTH  [BATTCOM_20MM_PTH]
C1  18p  C0402  [C0402]
C2  18p  C0402  [C0402]
C3  100n,16V,X7R  C0402  [C0402]
C4  100n,16V,X7R  C0402  [C0402]
C5  100n,16V,X7R  C0402  [C0402]
C6  100n,16V,X7R  C0402  [C0402]
C7  100n,16V,X7R  C0402  [C0402]
C8  100n,16V,X7R  C0402  [C0402]
C10  100n,16V,X7R  C0402  [C0402]
C11  100n,16V,X7R  C0402  [C0402]
C12  100n,16V,X7R  C0402  [C0402]
C13  100n,16V,X7R  C0402  [C0402]
C14  100n,16V,X7R  C0402  [C0402]
C15  100n,16V,X7R  C0402  [C0402]
C16  100n,16V,X7R  C0402  [C0402]
C17  100n,16V,X7R  C0402  [C0402]
C18  100n,16V,X7R  C0402  [C0402]
C20  100n,16V,X7R  C0402  [C0402]
C22  100n,16V,X7R  C0402  [C0402]
C23  10u,10V  C0603  [C0603]
C25  100n,16V,X7R  C0402  [C0402]
C26  10u,10V  C0603  [C0603]
C42  100n,16V,X7R  C0402  [C0402]
C43  100n,16V,X7R  C0402  [C0402]
C44  10u,10V,X7R  C0603  [C0603]
C45  1u,10V,X7R  C0402  [C0402]
C47  100n,16V,X7R  C0402  [C0402]
C49  100n,16V,X7R  C0402  [C0402]
C50  100n,16V,X7R  C0402  [C0402]
C63  100n,16V  C0402  [C0402]
C64  10u,10V  C0603  [C0603]
C65  100n,16V  C0402  [C0402]
C66  100n,16V  C0402  [C0402]
C67  1u,10V  C0402  [C0402]
C68  1u,10V  C0402  [C0402]
C69  100n,16V  C0402  [C0402]
C70  100n,16V  C0402  [C0402]
C71  100n,16V  C0402  [C0402]
C72  100n,16V  C0402  [C0402]
CN1  MICROSD_3M  [MICROSD]
IC2  TEMP_LM75B  [TSSOP8]
IC3  MPU9250  [QFN-24-NP]
IC6  PCA2129T  [SO16W]
IC11  TMS570LS3137ZWT  [S-PBGA-N337]
IC12  TEMP_LM75B  [TSSOP8]
IC13  TEMP_LM75B  [TSSOP8]
JTAG1  JTAG20-SMT1.27  [2X10_1.27MM_SMT]
L1  74479774210  WE-PMI_0805  [WE-PMI_0805]
L4  742792625  WE-CBF_0603  [0603]
LED1  R  LED0603  [CHIPLED_0603]
Q1  16M,18p  CRYSTAL43.2X2.5  [MT]
Q4  PMV65XP  BSS84  [SOT23]
R1  1k  R0402  [R0402]
R2  10k  R0402  [R0402]
R11  10k  R0402  [R0402]
R21  100  R0402  [R0402]
R22  22  R0402  [R0402]
R36  10k  R0402  [R0402]
R37  10k  R0402  [R0402]
R42  100  R0402  [R0402]
R45  10k  R0402  [R0402]
R46  10k  R0402  [R0402]
R47  10k  R0402  [R0402]
R48  10k  R0402  [R0402]
R49  10k  R0402  [R0402]
R50  10k  R0402  [R0402]
R51  10k  R0402  [R0402]
R52  10k  R0402  [R0402]
R53  100  R0402  [R0402]
R54  100  R0402  [R0402]
R55  10k  R0402  [R0402]
R56  10k  R0402  [R0402]
R57  10k  R0402  [R0402]
R58  100  R0402  [R0402]
R68  4.7k  R0402  [R0402]
R69  4.7k  R0402  [R0402]
U$23  4.096V  LT6656  [SOT23-6]

### Nets
5VFILT: C26.1 L1.2 U$23.4(VIN)
!ERROR: IC11.B14(SYSTEM:NERROR) LED1.C R37.1 ; also sheet 2
!INT_OUT: IC6.13(!INT) R56.1 R58.2
+1V2: C3.1 C4.1 C5.1 C6.1 C7.1 C8.1 C10.1 C11.1 IC11.F9(SYSTEM:VCC) IC11.F10(SYSTEM:VCC) IC11.H10(SYSTEM:VCC) IC11.J14(SYSTEM:VCC) IC11.K6(SYSTEM:VCC) IC11.K8(SYSTEM:VCC) IC11.K12(SYSTEM:VCC) IC11.K14(SYSTEM:VCC) IC11.L6(SYSTEM:VCC) IC11.M10(SYSTEM:VCC) IC11.P10(SYSTEM:VCC) IC11.P11(SYSTEM:VCCPLL) ; also sheet 2
+3V3: C12.1 C13.1 C14.1 C15.1 C16.1 C17.1 C18.1 C22.1 C42.1 C47.1 C49.1 C50.1 C65.1 C66.1 C69.1 C71.1 C72.1 IC2.5(A2) IC2.8(VCC) IC3.1(VDDIO) IC3.8(VDDIO) IC3.9(MOSI/AD0) IC3.22(!CS) IC6.16(VDD) IC11.F6(SYSTEM:VCCIO) IC11.F7(SYSTEM:VCCIO) IC11.F8(SYSTEM:VCCP) IC11.F11(SYSTEM:VCCIO) IC11.F12(SYSTEM:VCCIO) IC11.F13(SYSTEM:VCCIO) IC11.F14(SYSTEM:VCCIO) IC11.G6(SYSTEM:VCCIO) IC11.G14(SYSTEM:VCCIO) IC11.H6(SYSTEM:VCCIO) IC11.H14(SYSTEM:VCCIO) IC11.J6(SYSTEM:VCCIO) IC11.L14(SYSTEM:VCCIO) IC11.M6(SYSTEM:VCCIO) IC11.M14(SYSTEM:VCCIO) IC11.N6(SYSTEM:VCCIO) IC11.N14(SYSTEM:VCCIO) IC11.P6(SYSTEM:VCCIO) IC11.P7(SYSTEM:VCCIO) IC11.P8(SYSTEM:VCCIO) IC11.P9(SYSTEM:VCCIO) IC11.P12(SYSTEM:VCCIO) IC11.P13(SYSTEM:VCCIO) IC11.P14(SYSTEM:VCCIO) IC12.8(VCC) IC13.5(A2) IC13.6(A1) IC13.8(VCC) JTAG1.1 JTAG1.2 Q4.2(S) R1.2 R2.2 R36.2 R37.2 R52.2 R55.2 R56.2 R57.2 R68.2 R69.2 ; also sheet 2,3,4,5,7,8
+3V32: C68.1 L4.1 ; also sheet 2,8
+5V: C23.1 L1.1 ; also sheet 2,7,9
AGND: C23.2 C26.2 C64.2 U$23.1(GND) U$23.2(GND) ; also sheet 8
AREF: C64.1 U$23.6(VOUT) ; also sheet 8
BBS: C45.1 IC6.14(BBS)
CLKOUTOUT: IC6.7(CLKOUT) R57.1
GND: B1.B'(S1) B1.B(S) BAT1.2(-) C3.2 C4.2 C5.2 C6.2 C7.2 C8.2 C10.2 C11.2 C12.2 C13.2 C14.2 C15.2 C16.2 C17.2 C18.2 C20.2 C22.2 C25.2 C42.2 C43.2 C44.2 C45.2 C47.2 C49.2 C50.2 C63.2 C65.2 C66.2 C67.2 C68.2 C69.2 C70.2 C71.2 C72.2 CN1.6(GND) CN1.CD2(CARD_DETECT1) CN1.MT1(GND) CN1.MT2(GND) IC2.4(GND) IC2.6(A1) IC2.7(A0) IC3.11(FSYNC) IC3.18(GND) IC3.20(GND) IC6.5(IFS) IC6.8(VSS) IC11.A1(SYSTEM:VSS) IC11.A2(SYSTEM:VSS) IC11.A18(SYSTEM:VSS) IC11.A19(SYSTEM:VSS) IC11.B1(SYSTEM:VSS) IC11.B19(SYSTEM:VSS) IC11.H8(SYSTEM:VSS) IC11.H9(SYSTEM:VSS) IC11.H11(SYSTEM:VSS) IC11.H12(SYSTEM:VSS) IC11.J8(SYSTEM:VSS) IC11.J9(SYSTEM:VSS) IC11.J10(SYSTEM:VSS) IC11.J11(SYSTEM:VSS) IC11.J12(SYSTEM:VSS) IC11.K9(SYSTEM:VSS) IC11.K10(SYSTEM:VSS) IC11.K11(SYSTEM:VSS) IC11.L8(SYSTEM:VSS) IC11.L9(SYSTEM:VSS) IC11.L10(SYSTEM:VSS) IC11.L11(SYSTEM:VSS) IC11.L12(SYSTEM:VSS) IC11.M8(SYSTEM:VSS) IC11.M9(SYSTEM:VSS) IC11.M11(SYSTEM:VSS) IC11.M12(SYSTEM:VSS) IC11.U2(SYSTEM:TEST) IC11.V1(SYSTEM:VSS) IC11.W1(SYSTEM:VSS) IC11.W2(SYSTEM:VSS) IC12.4(GND) IC12.5(A2) IC12.6(A1) IC12.7(A0) IC13.4(GND) IC13.7(A0) JTAG1.4 JTAG1.6 JTAG1.8 JTAG1.10 JTAG1.12 JTAG1.14 JTAG1.16 JTAG1.18 JTAG1.20 R11.1 ; also sheet 2,3,4,5,7,8,9
KGND: C1.2 C2.1 IC11.L2(SYSTEM:KELVIN_GND) Q1.P2(GND) Q1.P4(GND1)
LED1A: LED1.A R1.1
MPU_INT: R22.2
MPUVCC: C67.1 C70.1 IC3.13(VDD) L4.2
N$62: IC3.12(INT) R22.1
NRST: C20.1 IC11.B17(SYSTEM:NRST) JTAG1.15 R2.1 R21.1
NRSTBTN: B1.A'(P1) B1.A(P) R21.2
OSCIN: C1.1 IC11.K1(SYSTEM:OSCIN) Q1.P3
OSCOUT: C2.2 IC11.L1(SYSTEM:OSCOUT) Q1.P1
PORRSTN: C25.1 IC11.W7(SYSTEM:NPORRST) R36.1 ; also sheet 2
REGOUT: C63.1 IC3.10(REGOUT)
RTC_!CS: IC6.4(SDA/!CE) R55.1 ; also sheet 8
RTC_!INT: R58.1 ; also sheet 8
RTC_SDO: IC6.3(SDO) R54.2
RTCK: IC11.A16(SYSTEM:RTCK) JTAG1.11
SCL: IC2.2(SCL) IC3.23(SCK/SCL) IC12.2(SCL) IC13.2(SCL) R68.1 ; also sheet 8
SD1_D2: CN1.1(DATA2) R50.1
SD_!CS: CN1.2(DATA3/SPI!CS) R51.1 ; also sheet 8
SD_+3V3: C43.1 C44.1 CN1.4(VDD) Q4.3(D) R45.2 R46.2 R47.2 R48.2 R49.2 R50.2 R51.2
SD_CD: R53.2 ; also sheet 8
SD_CDOUT: CN1.CD1(CARD_DETECT) R45.1 R53.1
SD_CLK: CN1.5(CLK/SPICLK) R46.1 ; also sheet 8
SD_D1: CN1.8(DATA1) R49.1
SD_EN: Q4.1(G) R52.1 ; also sheet 8
SD_MISO: R42.2 ; also sheet 8
SD_MOSI: CN1.3(CMD/SPIMOSI) R47.1 ; also sheet 8
SD_SDO_OUT: CN1.7(DATA0/SPIMISO) R42.1 R48.1
SDA: IC2.1(SDA) IC3.24(MISO/SDA) IC12.1(SDA) IC13.1(SDA) R69.1 ; also sheet 8
TCK: IC11.B18(SYSTEM:TCK) JTAG1.9
TDI: IC11.A17(SYSTEM:TDI) JTAG1.5
TDO: IC11.C18(SYSTEM:TDO) JTAG1.13
TMS: IC11.C19(SYSTEM:TMS) JTAG1.7
TPS_MISO: R54.1 ; also sheet 2,8
TPS_MOSI: IC6.2(SDI) ; also sheet 2,8
TPS_SCK: IC6.1(SCL) ; also sheet 2,8
TRST: IC11.D18(SYSTEM:NTRST) JTAG1.3 R11.2
VBAT: BAT1.1(+) IC6.15(VBAT)
Unconnected: IC2.3(OS) IC3.7(AUX_CL) IC3.21(AUX_DA) IC6.6(!TS) IC11.A12(SYSTEM:ECLK) IC11.C4(EMIF/ETM:EMIF_ADDR[6]/RTP_DATA[13]) IC11.C5(EMIF/ETM:EMIF_ADDR[7]/RTP_DATA[12]) IC11.C6(EMIF/ETM:EMIF_ADDR[8]/RTP_DATA[11]) IC11.C7(EMIF/ETM:EMIF_ADDR[9]/RTP_DATA[10]) IC11.C8(EMIF/ETM:EMIF_ADDR[10]/RTP_DATA[9]) IC11.C9(EMIF/ETM:EMIF_ADDR[11]/RTP_DATA[8]) IC11.C10(EMIF/ETM:EMIF_ADDR[12]/RTP_DATA[6]) IC11.C11(EMIF/ETM:EMIF_ADDR[13]/RTP_DATA[5]) IC11.C12(EMIF/ETM:EMIF_ADDR[14]/RTP_DATA[4]) IC11.C13(EMIF/ETM:EMIF_ADDR[15]/RTP_DATA[3]) IC11.C14(EMIF/ETM:EMIF_ADDR[17]/RTP_DATA[1]) IC11.C15(EMIF/ETM:EMIF_ADDR[19]/RTP_NENA) IC11.C16(EMIF/ETM:EMIF_ADDR[20]/RTP_NSYNC) IC11.C17(EMIF/ETM:EMIF_ADDR[21]/RTP_CLK) IC11.D4(EMIF/ETM:EMIF_ADDR[0]/N2HET2[1]) IC11.D5(EMIF/ETM:EMIF_ADDR[1]/N2HET2[3]) IC11.D14(EMIF/ETM:EMIF_ADDR[16]/RTP_DATA[2]) IC11.D15(EMIF/ETM:EMIF_ADDR[18]/RTP_DATA[0]) IC11.D16(EMIF/ETM:EMIF_BA[1]/N2HET2[5]) IC11.D17(EMIF/ETM:EMIF_NWE/EMIF_RNW) IC11.E5(EMIF/ETM:ETMDATA[20]/EMIF_DATA[4]) IC11.E6(EMIF/ETM:ETMDATA[11]/EMIF_ADDR[2]) IC11.E7(EMIF/ETM:ETMDATA[10]/EMIF_ADDR[3]) IC11.E8(EMIF/ETM:ETMDATA[9]/EMIF_ADDR[4]) IC11.E9(EMIF/ETM:ETMDATA[8]/EMIF_ADDR[5]) IC11.E10(EMIF/ETM:ETMDATA[15]/EMIF_NDQM[0]) IC11.E11(EMIF/ETM:ETMDATA[14]/EMIF_NDQM[1]) IC11.E12(EMIF/ETM:ETMDATA[13]/EMIF_NOE) IC11.E13(EMIF/ETM:ETMDATA[12]/EMIF_BA[0]) IC11.E14(EMIF/ETM:ETMDATA[7]) IC11.E15(EMIF/ETM:ETMDATA[6]) IC11.F5(EMIF/ETM:ETMDATA[21]/EMIF_DATA[5]) IC11.F15(EMIF/ETM:ETMDATA[5]) IC11.F16(EMIF/ETM:DMM_NENA) IC11.F17(EMIF/ETM:DMM_CLK) IC11.G5(EMIF/ETM:ETMDATA[22]/EMIF_DATA[6]) IC11.G15(EMIF/ETM:ETMDATA[4]) IC11.H5(SYSTEM:FLTP2) IC11.H15(EMIF/ETM:ETMDATA[3]) IC11.J5(SYSTEM:FLTP1) IC11.J15(EMIF/ETM:ETMDATA[2]) IC11.J16(EMIF/ETM:DMM_SYNC) IC11.K3(EMIF/ETM:EMIF_CLK) IC11.K5(EMIF/ETM:ETMDATA[23]/EMIF_DATA[7]) IC11.K15(EMIF/ETM:ETMDATA[16]/EMIF_DATA[0]) IC11.K17(EMIF/ETM:EMIF_NCS[3]/RTP_DATA[14]/N2HET2[9]) IC11.L3(EMIF/ETM:EMIF_CKE) IC11.L5(EMIF/ETM:ETMDATA[24]/EMIF_DATA[8]) IC11.L15(EMIF/ETM:ETMDATA[17]/EMIF_DATA[1]) IC11.L17(EMIF/ETM:EMIF_NCS[2]) IC11.L18(EMIF/ETM:DMM_DATA[1]) IC11.L19(EMIF/ETM:DMM_DATA[0]) IC11.M5(EMIF/ETM:ETMDATA[25]/EMIF_DATA[9]) IC11.M15(EMIF/ETM:ETMDATA[18]/EMIF_DATA[2]) IC11.M17(EMIF/ETM:EMIF_NCS[4]/RTP_DATA[7]) IC11.N5(EMIF/ETM:ETMDATA[26]/EMIF_DATA[10]) IC11.N15(EMIF/ETM:ETMDATA[19]/EMIF_DATA[3]) IC11.N17(EMIF/ETM:EMIF_NCS[0]/RTP_DATA[15]/N2HET2[7]) IC11.P3(EMIF/ETM:EMIF_NWAIT) IC11.P5(EMIF/ETM:ETMDATA[27]/EMIF_DATA[11]) IC11.R3(EMIF/ETM:EMIF_NRAS) IC11.R4(EMIF/ETM:EMIF_NCAS) IC11.R5(EMIF/ETM:ETMDATA[28]/EMIF_DATA[12]) IC11.R6(EMIF/ETM:ETMDATA[29]/EMIF_DATA[13]) IC11.R7(EMIF/ETM:ETMDATA[30]/EMIF_DATA[14]) IC11.R8(EMIF/ETM:ETMDATA[31]/EMIF_DATA[15]) IC11.R9(EMIF/ETM:ETMTRACECLKIN/EXTCLKIN2) IC11.R10(EMIF/ETM:ETMTRACECLKOUT) IC11.R11(EMIF/ETM:ETMTRACECTL) IC11.R12(EMIF/ETM:ETMDATA[0]) IC11.R13(EMIF/ETM:ETMDATA[1]) IC12.3(OS) IC13.3(OS) JTAG1.17 JTAG1.19

### Notes on the sheet
- SPI to uC (RTC+SD)
- 1.2V 3.3V
- Schraube zum sichern
  der Karte auf Board!

## Sheet 7 of 9
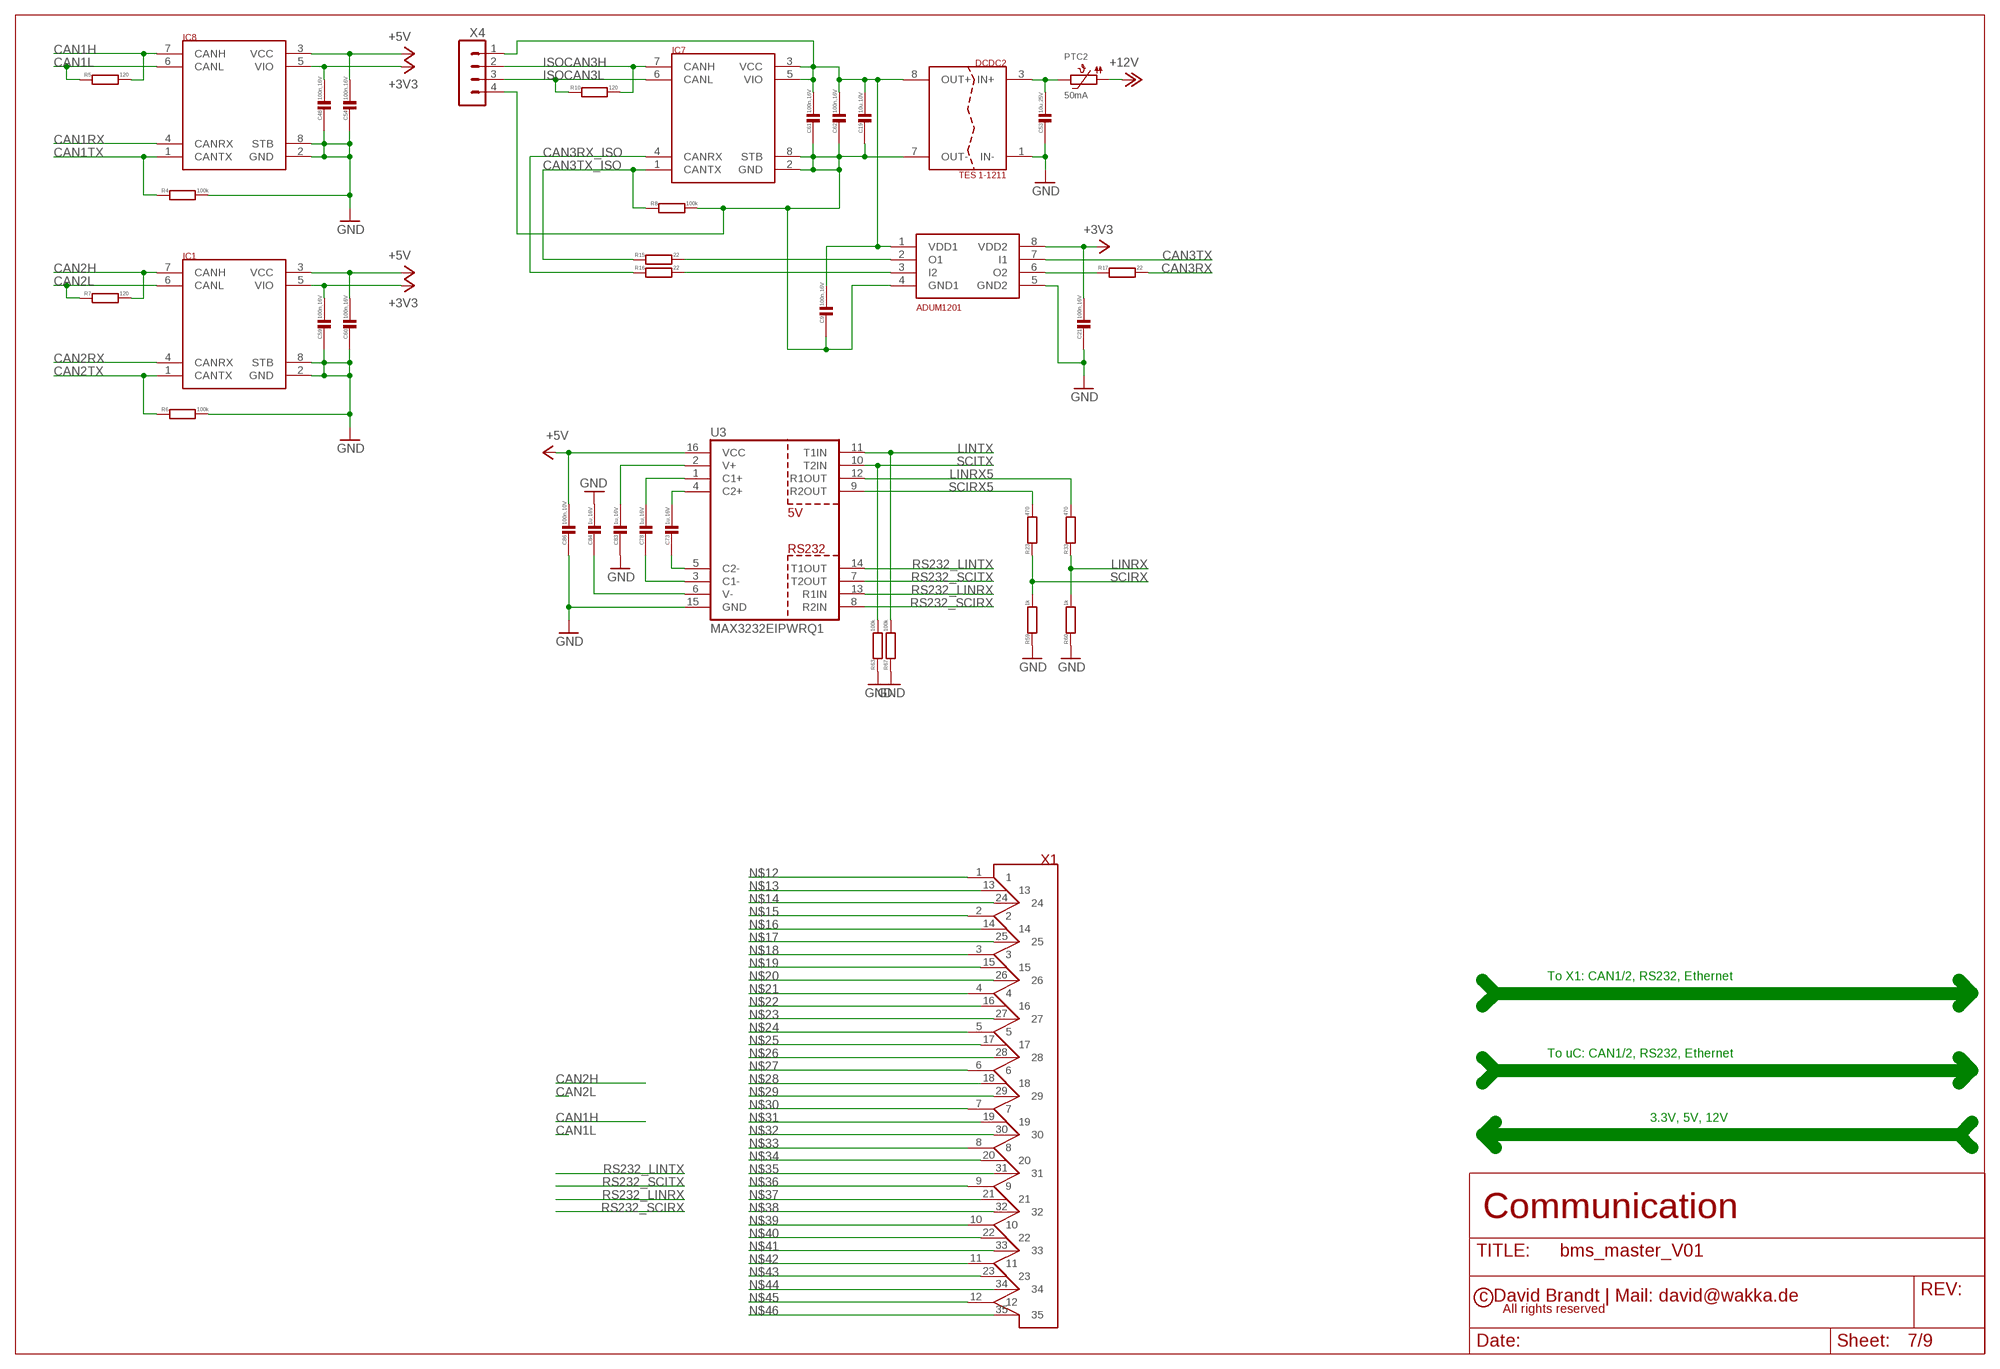
[diagram p6: schematic, sheet 7]

### Parts
C9  100n,16V  C0402  [C0402]
C19  10u,10V  C0603  [C0603]
C21  100n,16V  C0402  [C0402]
C48  100n,16V  C0402  [C0402]
C53  10u,25V  C1210  [C1210]
C54  100n,16V  C0402  [C0402]
C59  100n,16V  C0402  [C0402]
C60  100n,16V  C0402  [C0402]
C61  100n,16V  C0402  [C0402]
C62  100n,16V  C0402  [C0402]
C73  1u,16V  C0603  [C0603]
C78  1u,16V  C0603  [C0603]
C83  1u,16V  C0603  [C0603]
C84  1u,16V  C0603  [C0603]
C86  100n,10V  C0402  [C0402]
DCDC2  TES 1-1211  DCDC_ISOSMD_TES1  [DCDC_SMD_TES1]
IC1  SN65HVDA540  [SO-8]
IC7  SN65HVDA540  [SO-8]
IC8  SN65HVDA540  [SO-8]
PTC2  50mA  PTC1210  [PTC1210]
R4  100k  R0402  [R0402]
R5  120  R1206  [R1206]
R6  100k  R0402  [R0402]
R7  120  R1206  [R1206]
R8  100k  R0402  [R0402]
R10  120  R1206  [R1206]
R15  22  R1206  [R1206]
R16  22  R1206  [R1206]
R17  22  R1206  [R1206]
R23  470  R0402  [R0402]
R33  470  R0402  [R0402]
R59  1k  R0402  [R0402]
R60  1k  R0402  [R0402]
R63  100k  R0402  [R0402]
R67  100k  R0402  [R0402]
U3  MAX3232EIPWRQ1  MAX232TSSOP  [TSSOP16]
U$19  ADUM1201  [SO-8]
X1  AMPSEAL_35  [AMPSEAL_776231-1]
X4  HEADER_POS4_43650-0412  [43650-0412]

### Nets
+3V3: C21.1 C48.1 C59.1 IC1.5(VIO) IC8.5(VIO) U$19.8(VDD2) ; also sheet 2,3,4,5,6,8
+5V: C54.1 C60.1 C86.1 IC1.3(VCC) IC8.3(VCC) U3.16(VCC) ; also sheet 2,6,9
+12V: PTC2.P$1 ; also sheet 2,3,4,5
CAN1H: IC8.7(CANH) R5.2
CAN1L: IC8.6(CANL) R5.1
CAN1RX: IC8.4(CANRX) ; also sheet 8
CAN1TX: IC8.1(CANTX) R4.1 ; also sheet 8
CAN2H: IC1.7(CANH) R7.2
CAN2L: IC1.6(CANL) R7.1
CAN2RX: IC1.4(CANRX)
CAN2TX: IC1.1(CANTX) R6.1 ; also sheet 8
CAN3RX: R17.2 ; also sheet 8
CAN3RX_ISO: IC7.4(CANRX) R16.1
CAN3RXR: R17.1 U$19.6(O2)
CAN3TX: U$19.7(I1) ; also sheet 8
CAN3TX_ISO: IC7.1(CANTX) R8.1 R15.1
CLV_12V_TES1_FUSED1: C53.1 DCDC2.3(IN+) PTC2.P$2
GND: C21.2 C48.2 C53.2 C54.2 C59.2 C60.2 C83.2 C84.1 C86.2 DCDC2.1(IN-) IC1.2(GND) IC1.8(STB) IC8.2(GND) IC8.8(STB) R4.2 R6.2 R59.1 R60.1 R63.1 R67.1 U3.15(GND) U$19.5(GND2) ; also sheet 2,3,4,5,6,8,9
ISOCAN3H: IC7.7(CANH) R10.2 X4.2
ISOCAN3L: IC7.6(CANL) R10.1 X4.3
ISOCAN_5V: C9.1 C19.1 C61.1 C62.1 DCDC2.8(OUT+) IC7.3(VCC) IC7.5(VIO) U$19.1(VDD1) X4.1
ISOCAN_GND: C9.2 C19.2 C61.2 C62.2 DCDC2.7(OUT-) IC7.2(GND) IC7.8(STB) R8.2 U$19.4(GND1) X4.4
LINRX: R33.1 R60.2 ; also sheet 8
LINRX5: R33.2 U3.12(R1OUT)
LINTX: R67.2 U3.11(T1IN) ; also sheet 8
N$12: X1.1
N$13: X1.13
N$14: X1.24
N$15: X1.2
N$16: X1.14
N$17: X1.25
N$18: X1.3
N$19: X1.15
N$20: X1.26
N$21: X1.4
N$22: X1.16
N$23: X1.27
N$24: X1.5
N$25: X1.17
N$26: X1.28
N$27: X1.6
N$28: X1.18
N$29: X1.29
N$30: X1.7
N$31: X1.19
N$32: X1.30
N$33: X1.8
N$34: X1.20
N$35: X1.31
N$36: X1.9
N$37: X1.21
N$38: X1.32
N$39: X1.10
N$40: X1.22
N$41: X1.33
N$42: X1.11
N$43: X1.23
N$44: X1.34
N$45: X1.12
N$46: X1.35
N$49: R16.2 U$19.3(I2)
N$51: C73.1 U3.4(C2+)
N$52: C78.1 U3.1(C1+)
N$53: C83.1 U3.2(V+)
N$54: C73.2 U3.5(C2-)
N$55: R15.2 U$19.2(O1)
N$56: C78.2 U3.3(C1-)
N$57: C84.2 U3.6(V-)
RS232_LINRX: U3.13(R1IN)
RS232_LINTX: U3.14(T1OUT)
RS232_SCIRX: U3.8(R2IN)
RS232_SCITX: U3.7(T2OUT)
SCIRX: R23.1 R59.2 ; also sheet 8
SCIRX5: R23.2 U3.9(R2OUT)
SCITX: R63.2 U3.10(T2IN) ; also sheet 8

### Notes on the sheet
- To X1: CAN1/2, RS232, Ethernet
- To uC: CAN1/2, RS232, Ethernet
- 3.3V, 5V, 12V

## Sheet 8 of 9
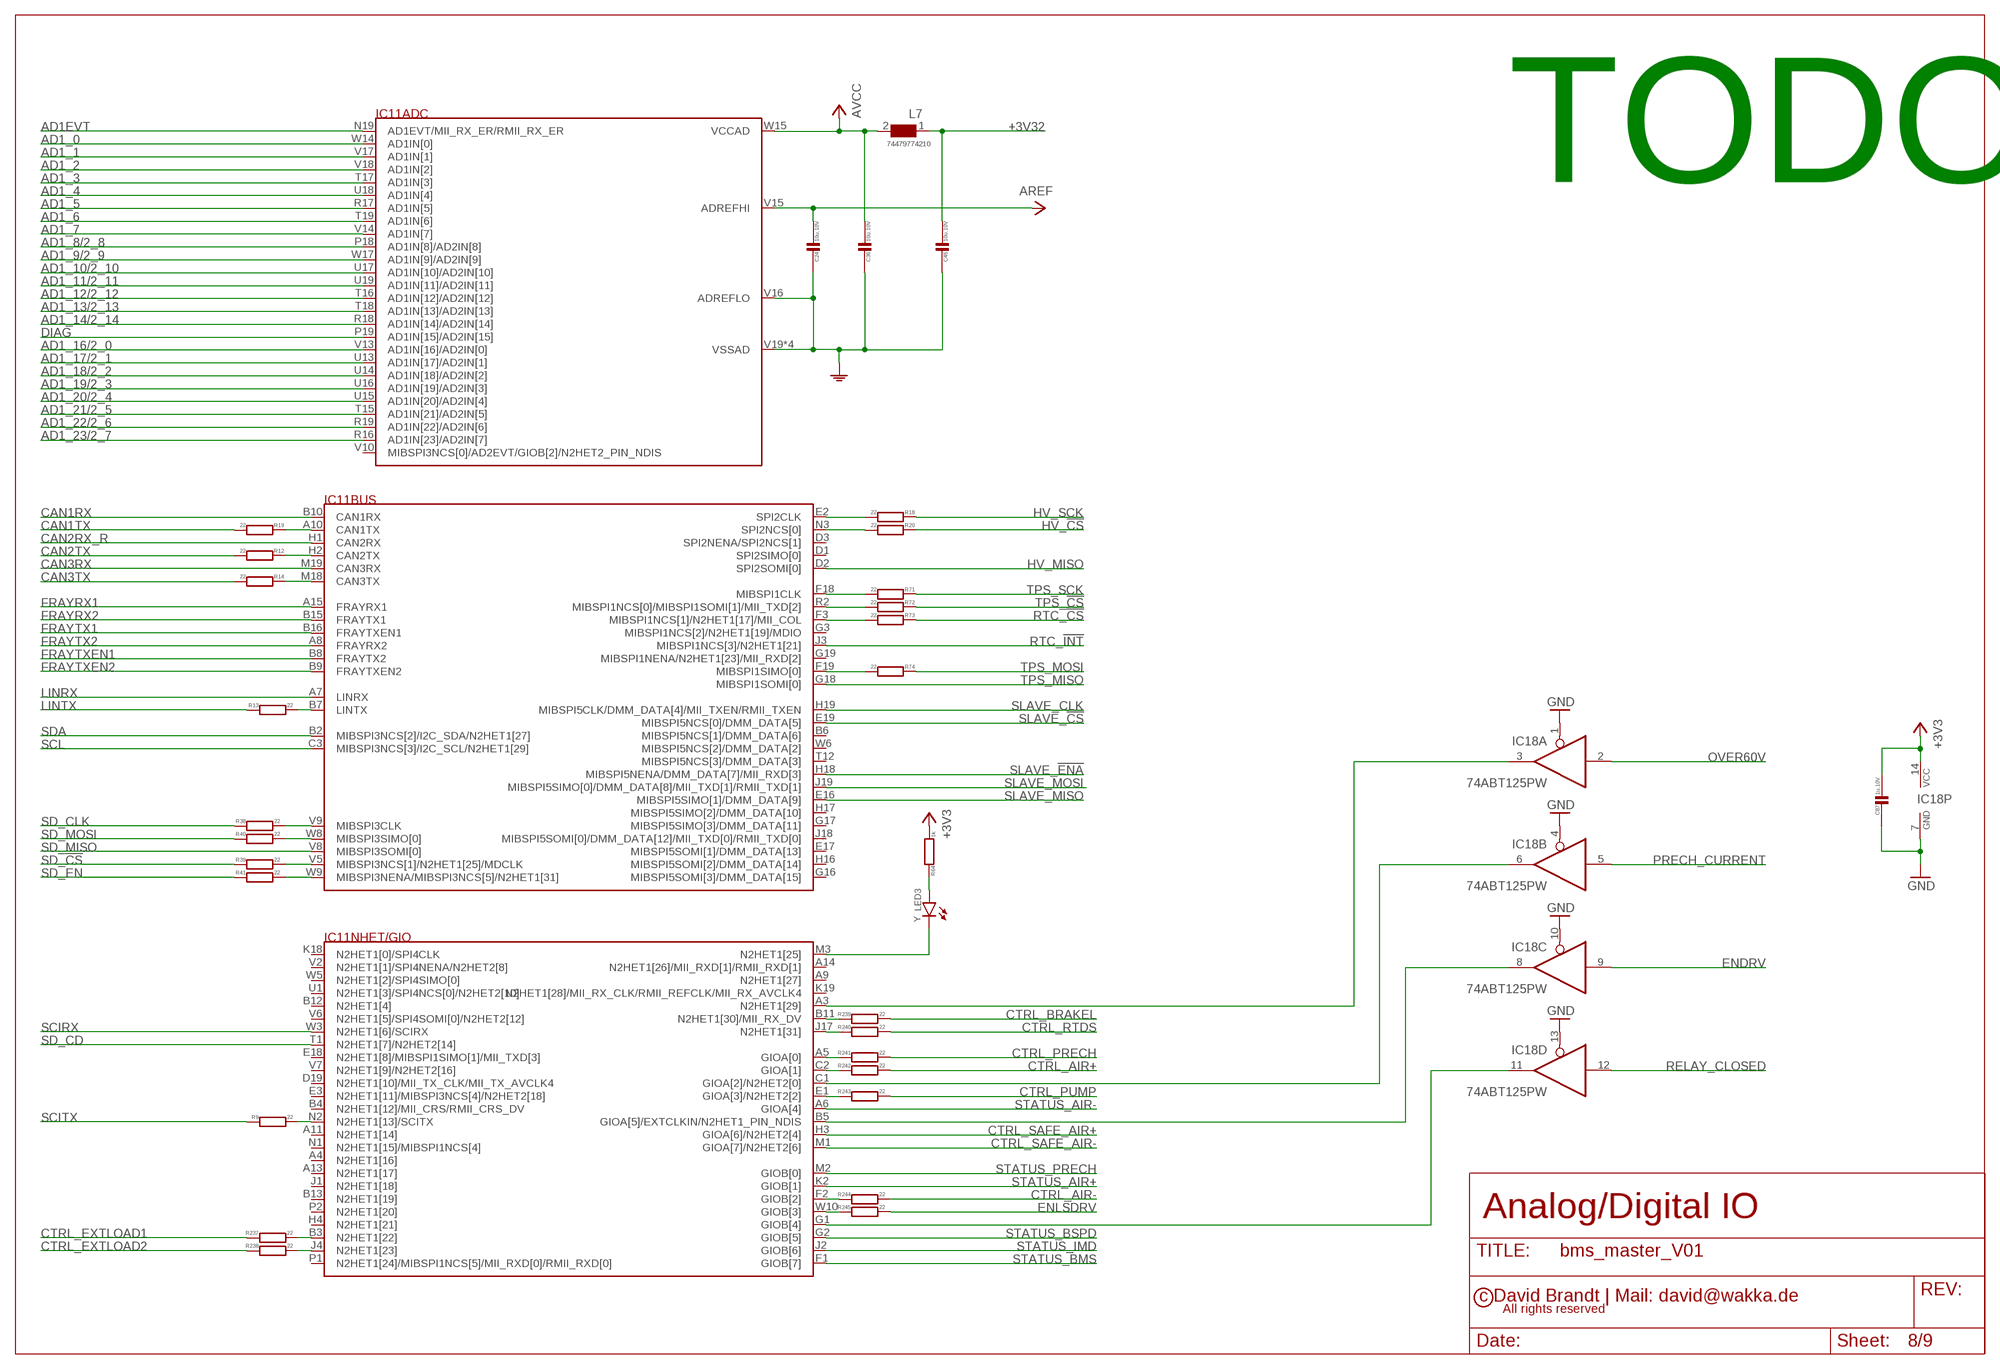
[diagram p7: schematic, sheet 8]

### Parts
C24  10u,10V  C0603  [C0603]
C36  10u,10V  C0603  [C0603]
C46  10u,10V  C0603  [C0603]
C87  1u,10V  C0402  [C0402]
IC18  74ABT125PW  [TSSOP14]
L7  74479774210  WE-PMI_0805  [WE-PMI_0805]
LED3  Y  LED0603  [CHIPLED_0603]
R9  22  R0402  [R0402]
R12  22  R0402  [R0402]
R13  22  R0402  [R0402]
R14  22  R0402  [R0402]
R18  22  R0402  [R0402]
R19  22  R0402  [R0402]
R20  22  R0402  [R0402]
R38  22  R0402  [R0402]
R39  22  R0402  [R0402]
R40  22  R0402  [R0402]
R41  22  R0402  [R0402]
R64  1k  R0402  [R0402]
R71  22  R0402  [R0402]
R72  22  R0402  [R0402]
R73  22  R0402  [R0402]
R74  22  R0402  [R0402]
R237  22  R0402  [R0402]
R238  22  R0402  [R0402]
R239  22  R0402  [R0402]
R240  22  R0402  [R0402]
R241  22  R0402  [R0402]
R242  22  R0402  [R0402]
R243  22  R0402  [R0402]
R244  22  R0402  [R0402]
R245  22  R0402  [R0402]

### Nets
+3V3: C87.1 IC18.14(P:VCC) R64.2 ; also sheet 2,3,4,5,6,7
+3V32: C46.1 L7.1 ; also sheet 2,6
AD1_0: IC11.W14(ADC:AD1IN[0])
AD1_1: IC11.V17(ADC:AD1IN[1])
AD1_2: IC11.V18(ADC:AD1IN[2])
AD1_3: IC11.T17(ADC:AD1IN[3])
AD1_4: IC11.U18(ADC:AD1IN[4])
AD1_5: IC11.R17(ADC:AD1IN[5])
AD1_6: IC11.T19(ADC:AD1IN[6])
AD1_7: IC11.V14(ADC:AD1IN[7])
AD1_8/2_8: IC11.P18(ADC:AD1IN[8]/AD2IN[8])
AD1_9/2_9: IC11.W17(ADC:AD1IN[9]/AD2IN[9])
AD1_10/2_10: IC11.U17(ADC:AD1IN[10]/AD2IN[10])
AD1_11/2_11: IC11.U19(ADC:AD1IN[11]/AD2IN[11])
AD1_12/2_12: IC11.T16(ADC:AD1IN[12]/AD2IN[12])
AD1_13/2_13: IC11.T18(ADC:AD1IN[13]/AD2IN[13])
AD1_14/2_14: IC11.R18(ADC:AD1IN[14]/AD2IN[14])
AD1_16/2_0: IC11.V13(ADC:AD1IN[16]/AD2IN[0])
AD1_17/2_1: IC11.U13(ADC:AD1IN[17]/AD2IN[1])
AD1_18/2_2: IC11.U14(ADC:AD1IN[18]/AD2IN[2])
AD1_19/2_3: IC11.U16(ADC:AD1IN[19]/AD2IN[3])
AD1_20/2_4: IC11.U15(ADC:AD1IN[20]/AD2IN[4])
AD1_21/2_5: IC11.T15(ADC:AD1IN[21]/AD2IN[5])
AD1_22/2_6: IC11.R19(ADC:AD1IN[22]/AD2IN[6])
AD1_23/2_7: IC11.R16(ADC:AD1IN[23]/AD2IN[7])
AD1EVT: IC11.N19(ADC:AD1EVT/MII_RX_ER/RMII_RX_ER)
AGND: C24.2 C36.2 C46.2 IC11.V16(ADC:ADREFLO) IC11.V19(ADC:VSSAD) IC11.W16(ADC:VSSAD) IC11.W18(ADC:VSSAD) IC11.W19(ADC:VSSAD) ; also sheet 6
AREF: C24.1 IC11.V15(ADC:ADREFHI) ; also sheet 6
AVCC: C36.1 IC11.W15(ADC:VCCAD) L7.2
CAN1RX: IC11.B10(BUS:CAN1RX) ; also sheet 7
CAN1TX: R19.2 ; also sheet 7
CAN1TX_R: IC11.A10(BUS:CAN1TX) R19.1
CAN2RX_R: IC11.H1(BUS:CAN2RX)
CAN2TX: R12.2 ; also sheet 7
CAN2TX_R: IC11.H2(BUS:CAN2TX) R12.1
CAN3RX: IC11.M19(BUS:CAN3RX) ; also sheet 7
CAN3TX: R14.2 ; also sheet 7
CAN3TX_R: IC11.M18(BUS:CAN3TX) R14.1
CTRL_AIR+: R242.2 ; also sheet 5
CTRL_AIR-: R244.2 ; also sheet 5
CTRL_BRAKEL: R239.2 ; also sheet 5,9
CTRL_EXTLOAD1: R237.1 ; also sheet 5
CTRL_EXTLOAD2: R238.1 ; also sheet 5
CTRL_PRECH: R241.2 ; also sheet 5
CTRL_PUMP: R243.2 ; also sheet 5,9
CTRL_RTDS: R240.2 ; also sheet 5,9
CTRL_SAFE_AIR+: IC11.H3(NHET/GIO:GIOA[6]/N2HET2[4]) ; also sheet 5
CTRL_SAFE_AIR-: IC11.M1(NHET/GIO:GIOA[7]/N2HET2[6]) ; also sheet 5
DIAG: IC11.P19(ADC:AD1IN[15]/AD2IN[15]) ; also sheet 2
ENDRV: IC18.9(C:I) ; also sheet 2,5
ENLSDRV: R245.2 ; also sheet 5
FRAYRX1: IC11.A15(BUS:FRAYRX1)
FRAYRX2: IC11.B15(BUS:FRAYTX1)
FRAYTX1: IC11.B16(BUS:FRAYTXEN1)
FRAYTX2: IC11.A8(BUS:FRAYRX2)
FRAYTXEN1: IC11.B8(BUS:FRAYTX2)
FRAYTXEN2: IC11.B9(BUS:FRAYTXEN2)
GND: C87.2 IC18.1(A:OE) IC18.4(B:OE) IC18.7(P:GND) IC18.10(C:OE) IC18.13(D:OE) ; also sheet 2,3,4,5,6,7,9
HV_!CS: R20.1 ; also sheet 3
HV_MISO: IC11.D2(BUS:SPI2SOMI[0]) ; also sheet 3
HV_SCK: R18.1 ; also sheet 3
LED1A2: LED3.A R64.1
LINRX: IC11.A7(BUS:LINRX) ; also sheet 7
LINTX: R13.1 ; also sheet 7
N$58: IC11.B7(BUS:LINTX) R13.2
N$59: IC11.N2(NHET/GIO:N2HET1[13]/SCITX) R9.2
N$60: IC11.E2(BUS:SPI2CLK) R18.2
N$61: IC11.N3(BUS:SPI2NCS[0]) R20.2
N$85: IC11.G1(NHET/GIO:GIOB[4]) IC18.11(D:O)
N$138: IC11.B3(NHET/GIO:N2HET1[22]) R237.2
N$139: IC11.J4(NHET/GIO:N2HET1[23]) R238.2
N$140: IC11.F2(NHET/GIO:GIOB[2]) R244.1
N$141: IC11.E1(NHET/GIO:GIOA[3]/N2HET2[2]) R243.1
N$142: IC11.C2(NHET/GIO:GIOA[1]) R242.1
N$143: IC11.A5(NHET/GIO:GIOA[0]) R241.1
N$144: IC11.J17(NHET/GIO:N2HET1[31]) R240.1
N$145: IC11.B11(NHET/GIO:N2HET1[30]/MII_RX_DV) R239.1
N$146: IC11.W10(NHET/GIO:GIOB[3]) R245.1
N$180: IC11.M3(NHET/GIO:N2HET1[25]) LED3.C
N$192: IC11.B5(NHET/GIO:GIOA[5]/EXTCLKIN/N2HET1_PIN_NDIS) IC18.8(C:O)
N$205: IC11.C1(NHET/GIO:GIOA[2]/N2HET2[0]) IC18.6(B:O)
N$206: IC11.A3(NHET/GIO:N2HET1[29]) IC18.3(A:O)
OVER60V: IC18.2(A:I) ; also sheet 3,4
PRECH_CURRENT: IC18.5(B:I) ; also sheet 3,5
RELAY_CLOSED: IC18.12(D:I) ; also sheet 4,5
RTC_!CS: R73.1 ; also sheet 6
RTC_!CSR1: IC11.F3(BUS:MIBSPI1NCS[1]/N2HET1[17]/MII_COL) R73.2
RTC_!INT: IC11.J3(BUS:MIBSPI1NCS[3]/N2HET1[21]) ; also sheet 6
SCIRX: IC11.W3(NHET/GIO:N2HET1[6]/SCIRX) ; also sheet 7
SCITX: R9.1 ; also sheet 7
SCL: IC11.C3(BUS:MIBSPI3NCS[3]/I2C_SCL/N2HET1[29]) ; also sheet 6
SD_!CS: R39.1 ; also sheet 6
SD_!CS_R: IC11.V5(BUS:MIBSPI3NCS[1]/N2HET1[25]/MDCLK) R39.2
SD_CD: IC11.T1(NHET/GIO:N2HET1[7]/N2HET2[14]) ; also sheet 6
SD_CLK: R38.1 ; also sheet 6
SD_CLK_R: IC11.V9(BUS:MIBSPI3CLK) R38.2
SD_EN: R41.1 ; also sheet 6
SD_EN_R: IC11.W9(BUS:MIBSPI3NENA/MIBSPI3NCS[5]/N2HET1[31]) R41.2
SD_MISO: IC11.V8(BUS:MIBSPI3SOMI[0]) ; also sheet 6
SD_MOSI: R40.1 ; also sheet 6
SD_MOSI_R: IC11.W8(BUS:MIBSPI3SIMO[0]) R40.2
SDA: IC11.B2(BUS:MIBSPI3NCS[2]/I2C_SDA/N2HET1[27]) ; also sheet 6
SLAVE_!CS: IC11.E19(BUS:MIBSPI5NCS[0]/DMM_DATA[5])
SLAVE_!ENA: IC11.H18(BUS:MIBSPI5NENA/DMM_DATA[7]/MII_RXD[3])
SLAVE_CLK: IC11.H19(BUS:MIBSPI5CLK/DMM_DATA[4]/MII_TXEN/RMII_TXEN)
SLAVE_MISO: IC11.E16(BUS:MIBSPI5SIMO[1]/DMM_DATA[9])
SLAVE_MOSI: IC11.J19(BUS:MIBSPI5SIMO[0]/DMM_DATA[8]/MII_TXD[1]/RMII_TXD[1])
STATUS_AIR+: IC11.K2(NHET/GIO:GIOB[1])
STATUS_AIR-: IC11.A6(NHET/GIO:GIOA[4])
STATUS_BMS: IC11.F1(NHET/GIO:GIOB[7]) ; also sheet 4
STATUS_BSPD: IC11.G2(NHET/GIO:GIOB[5]) ; also sheet 4
STATUS_IMD: IC11.J2(NHET/GIO:GIOB[6]) ; also sheet 4
STATUS_PRECH: IC11.M2(NHET/GIO:GIOB[0])
TPS_!CS: R72.1 ; also sheet 2
TPS_!CSR1: IC11.R2(BUS:MIBSPI1NCS[0]/MIBSPI1SOMI[1]/MII_TXD[2]) R72.2
TPS_MISO: IC11.G18(BUS:MIBSPI1SOMI[0]) ; also sheet 2,6
TPS_MOSI: R74.1 ; also sheet 2,6
TPS_MOSIR1: IC11.F19(BUS:MIBSPI1SIMO[0]) R74.2
TPS_SCK: R71.1 ; also sheet 2,6
TPS_SCKR1: IC11.F18(BUS:MIBSPI1CLK) R71.2
Unconnected: IC11.A4(NHET/GIO:N2HET1[16]) IC11.A9(NHET/GIO:N2HET1[27]) IC11.A11(NHET/GIO:N2HET1[14]) IC11.A13(NHET/GIO:N2HET1[17]) IC11.A14(NHET/GIO:N2HET1[26]/MII_RXD[1]/RMII_RXD[1]) IC11.B4(NHET/GIO:N2HET1[12]/MII_CRS/RMII_CRS_DV) IC11.B6(BUS:MIBSPI5NCS[1]/DMM_DATA[6]) IC11.B12(NHET/GIO:N2HET1[4]) IC11.B13(NHET/GIO:N2HET1[19]) IC11.D1(BUS:SPI2SIMO[0]) IC11.D3(BUS:SPI2NENA/SPI2NCS[1]) IC11.D19(NHET/GIO:N2HET1[10]/MII_TX_CLK/MII_TX_AVCLK4) IC11.E3(NHET/GIO:N2HET1[11]/MIBSPI3NCS[4]/N2HET2[18]) IC11.E17(BUS:MIBSPI5SOMI[1]/DMM_DATA[13]) IC11.E18(NHET/GIO:N2HET1[8]/MIBSPI1SIMO[1]/MII_TXD[3]) IC11.G3(BUS:MIBSPI1NCS[2]/N2HET1[19]/MDIO) IC11.G16(BUS:MIBSPI5SOMI[3]/DMM_DATA[15]) IC11.G17(BUS:MIBSPI5SIMO[3]/DMM_DATA[11]) IC11.G19(BUS:MIBSPI1NENA/N2HET1[23]/MII_RXD[2]) IC11.H4(NHET/GIO:N2HET1[21]) IC11.H16(BUS:MIBSPI5SOMI[2]/DMM_DATA[14]) IC11.H17(BUS:MIBSPI5SIMO[2]/DMM_DATA[10]) IC11.J1(NHET/GIO:N2HET1[18]) IC11.J18(BUS:MIBSPI5SOMI[0]/DMM_DATA[12]/MII_TXD[0]/RMII_TXD[0]) IC11.K18(NHET/GIO:N2HET1[0]/SPI4CLK) IC11.K19(NHET/GIO:N2HET1[28]/MII_RX_CLK/RMII_REFCLK/MII_RX_AVCLK4) IC11.N1(NHET/GIO:N2HET1[15]/MIBSPI1NCS[4]) IC11.P1(NHET/GIO:N2HET1[24]/MIBSPI1NCS[5]/MII_RXD[0]/RMII_RXD[0]) IC11.P2(NHET/GIO:N2HET1[20]) IC11.T12(BUS:MIBSPI5NCS[3]/DMM_DATA[3]) IC11.U1(NHET/GIO:N2HET1[3]/SPI4NCS[0]/N2HET2[10]) IC11.V2(NHET/GIO:N2HET1[1]/SPI4NENA/N2HET2[8]) IC11.V6(NHET/GIO:N2HET1[5]/SPI4SOMI[0]/N2HET2[12]) IC11.V7(NHET/GIO:N2HET1[9]/N2HET2[16]) IC11.V10(ADC:MIBSPI3NCS[0]/AD2EVT/GIOB[2]/N2HET2_PIN_NDIS) IC11.W5(NHET/GIO:N2HET1[2]/SPI4SIMO[0]) IC11.W6(BUS:MIBSPI5NCS[2]/DMM_DATA[2])

### Notes on the sheet
- TODO